# Altium project BEE-1012 PAY-EXP_V110.PrjPcb (part 1 of 7)
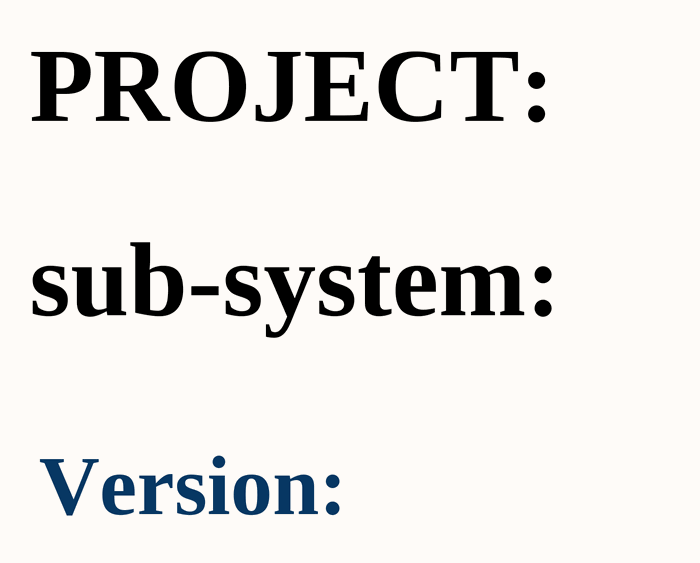
[diagram p0: 01_COVER PAGE.SchDoc]
ApprovedBy: Vu Pham; CheckedBy: Bao Bui; Date: 03/11/2026; DrawnBy: Cam Doan; MasterProject: BEE-1012; Revision: 1.1.0; SubSystem: PAY-EXP
36 sheets, 1379 parts. Net scope: flat (ports and power ports of the same name join across sheets).
Board file: BEE_1012 PAY-EXP V110.PcbDoc
Sheets:
  01_COVER PAGE.SchDoc
  02_BLOCK DIAGRAM.SchDoc
  03_INDEX.SchDoc
  04_POWER_TREE.SchDoc
  05_CONNECTOR_IN.SchDoc
  05_CONNECTOR_OUT.SchDoc
  06_POWER_1.SchDoc
  06_POWER_2.SchDoc
  06_POWER_3.SchDoc
  06_POWER_4.SchDoc
  06_POWER_5.SchDoc
  07_CAN.SchDoc
  08_SAMA7G54-MPU.SchDoc
  08_SAMA7G54-PMIC.SchDoc
  08_SAMA7G54-PIO.SchDoc
  08_SAMA7G54-DDR3.SchDoc
  08_SOM_USB_CARD.SchDoc
  09_eMMC.SchDoc
  10_USB.SchDoc
  11_MCU.SchDoc
  12_CONSOLE.SchDoc
  13_MRAM_RTC_WDT.SchDoc
  13_PRAM.SchDoc
  14_NTC_TEMPSENSOR.SchDoc
  15_HEATER.SchDoc
  16_TEC.SchDoc
  17_FLOW_Sensor.SchDoc
  17_I2C_Sensor_OnBoard.SchDoc
  18_HD4_PUMP.SchDoc
  18_HD4_PUMP_2.SchDoc
  19_SOLENOID_HB_1.SchDoc
  19_SOLENOID_OF.SchDoc
  20_AI_Board.SchDoc
  21_POWER_PWR_SEN.SchDoc
  MOUTING.SchDoc
  ANA_SWITCH.SchDoc

## Sheet 01_COVER PAGE.SchDoc
size 420 x 297 mm; DrawnBy: Sang Huynh; SheetNumber: 1; SheetTotal: 35; MasterProject: BEE-1012

### Notes on the sheet
- PROJECT:
- sub-system:
- Version:
- Project:
- Sub-system:
- Design by:
- Sheet title:
- Sheet
- of
- Checked by:
- Approved by:
- Revision:
- Document No:
- Size:
- Date:
- A3

## Sheet 02_BLOCK DIAGRAM.SchDoc
size 420 x 297 mm; SheetNumber: 2; SheetTotal: 35

### Notes on the sheet
- Project:
- Sub-system:
- Design by:
- Sheet title:
- Sheet
- of
- Checked by:
- Approved by:
- Revision:
- Document No:
- Size:
- Date:
- A3

## Sheet 03_INDEX.SchDoc
size 420 x 297 mm; SheetNumber: 3; SheetTotal: 35
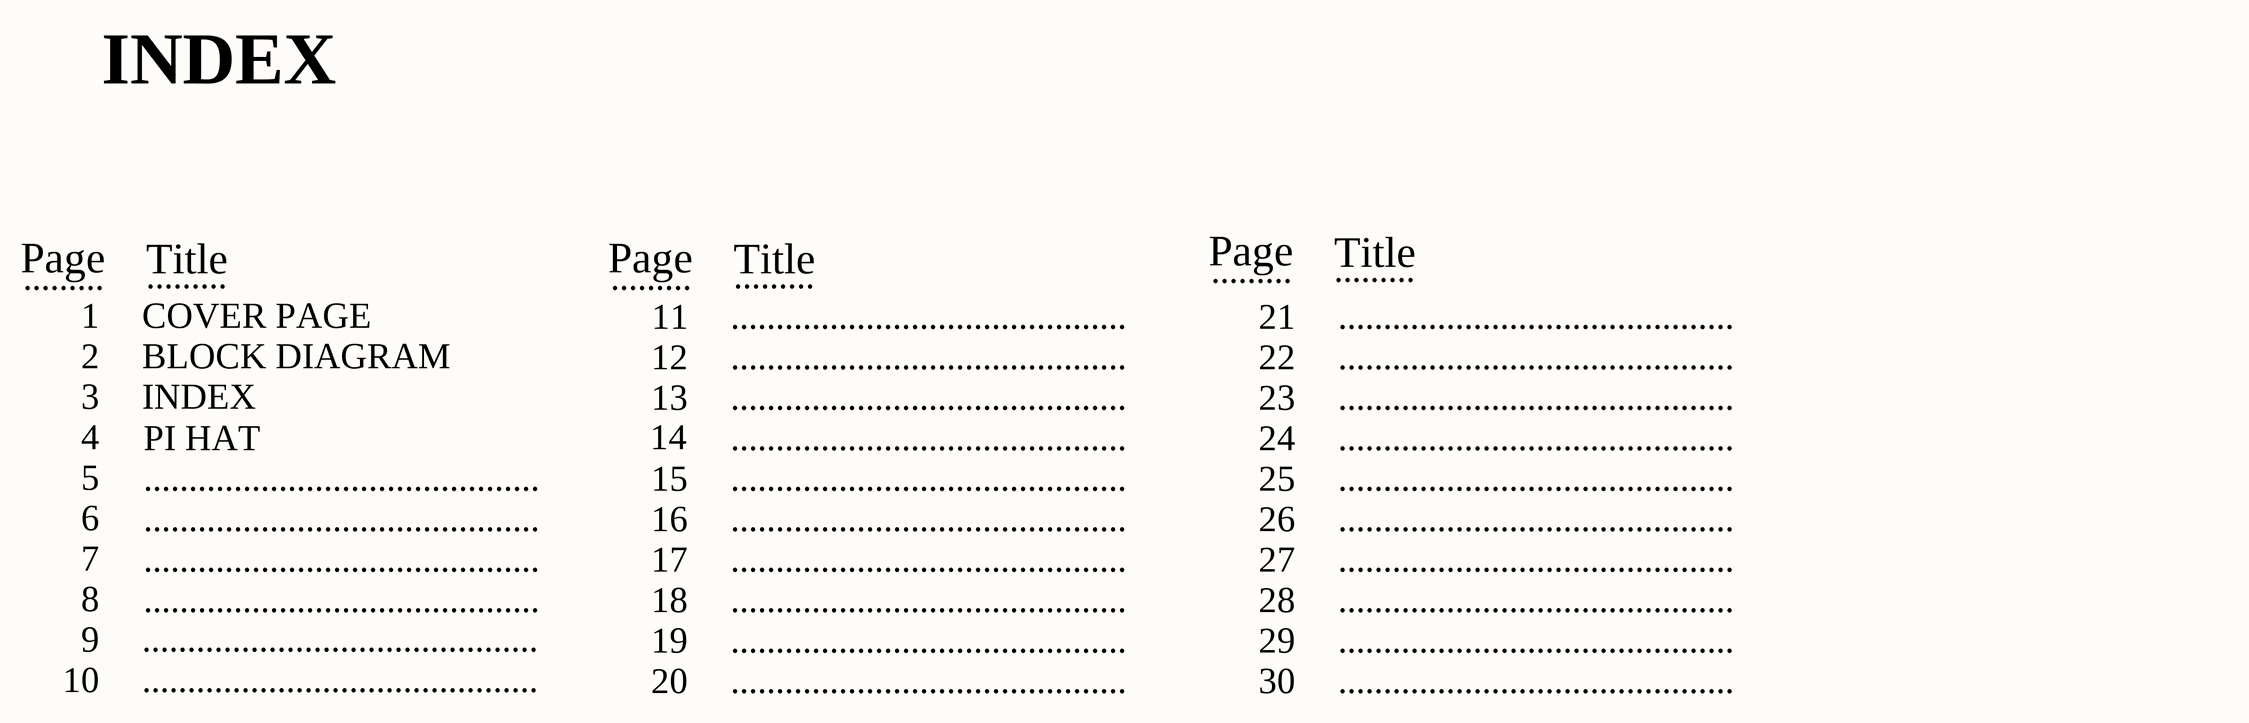
[diagram p1: 03_INDEX.SchDoc]

### Notes on the sheet
- INDEX
- Page
- .........
- Title
- 1
- 2
- COVER PAGE
- BLOCK DIAGRAM
- 11
- 12
- ............................................
- 21
- 22
- 3
- 4
- 14
- 13
- 23
- 5
- PI HAT
- 15
- 24
- 25
- 6
- 7
- 16
- 17
- 26
- 27
- 8
- 18
- 28
- 9
- 10
- 19
- 20
- 29
- 30
- Project:
- Sub-system:
- Design by:
- Sheet title:
- Sheet
- of
- Checked by:
- Approved by:
- Revision:
- Document No:
- Size:
- Date:
- A3

## Sheet 04_POWER_TREE.SchDoc
size 420 x 297 mm; SheetNumber: 4; SheetTotal: 35
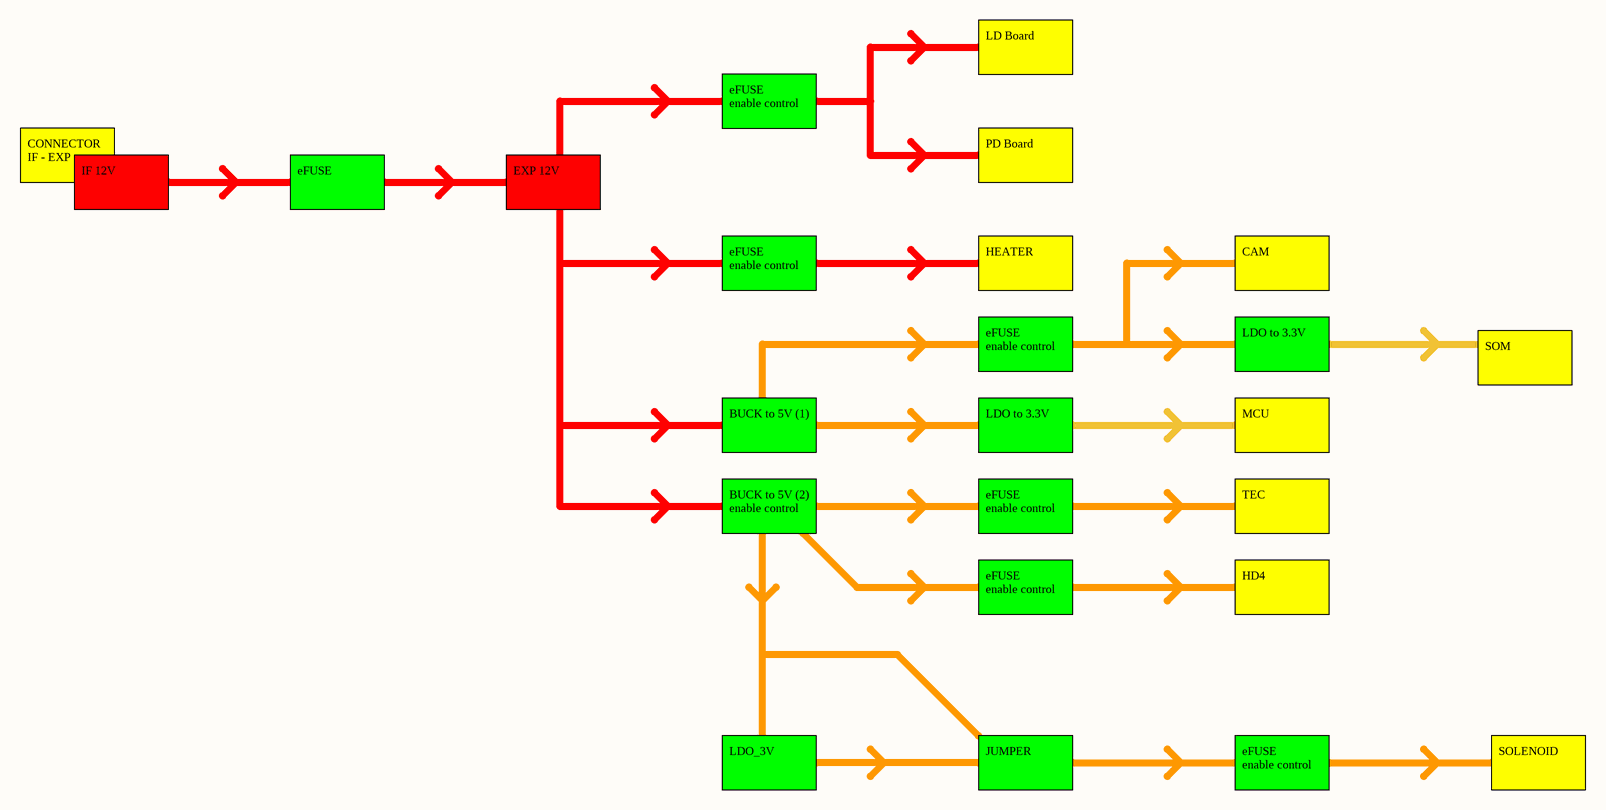
[diagram p2: 04_POWER_TREE.SchDoc]

### Notes on the sheet
- LD Board
- eFUSE
  enable control
- CONNECTOR
  IF - EXP
- IF 12V
- eFUSE
- EXP 12V
- PD Board
- HEATER
- CAM
- LDO to 3.3V
- SOM
- BUCK to 5V (1)
- MCU
- BUCK to 5V (2)
  enable control
- TEC
- HD4
- LDO_3V
- JUMPER
- SOLENOID
- Project:
- Sub-system:
- Design by:
- Sheet title:
- Sheet
- of
- Checked by:
- Approved by:
- Revision:
- Document No:
- Size:
- Date:
- A3

## Sheet 05_CONNECTOR_IN.SchDoc
size 420 x 297 mm; SheetNumber: 5; SheetTotal: 36
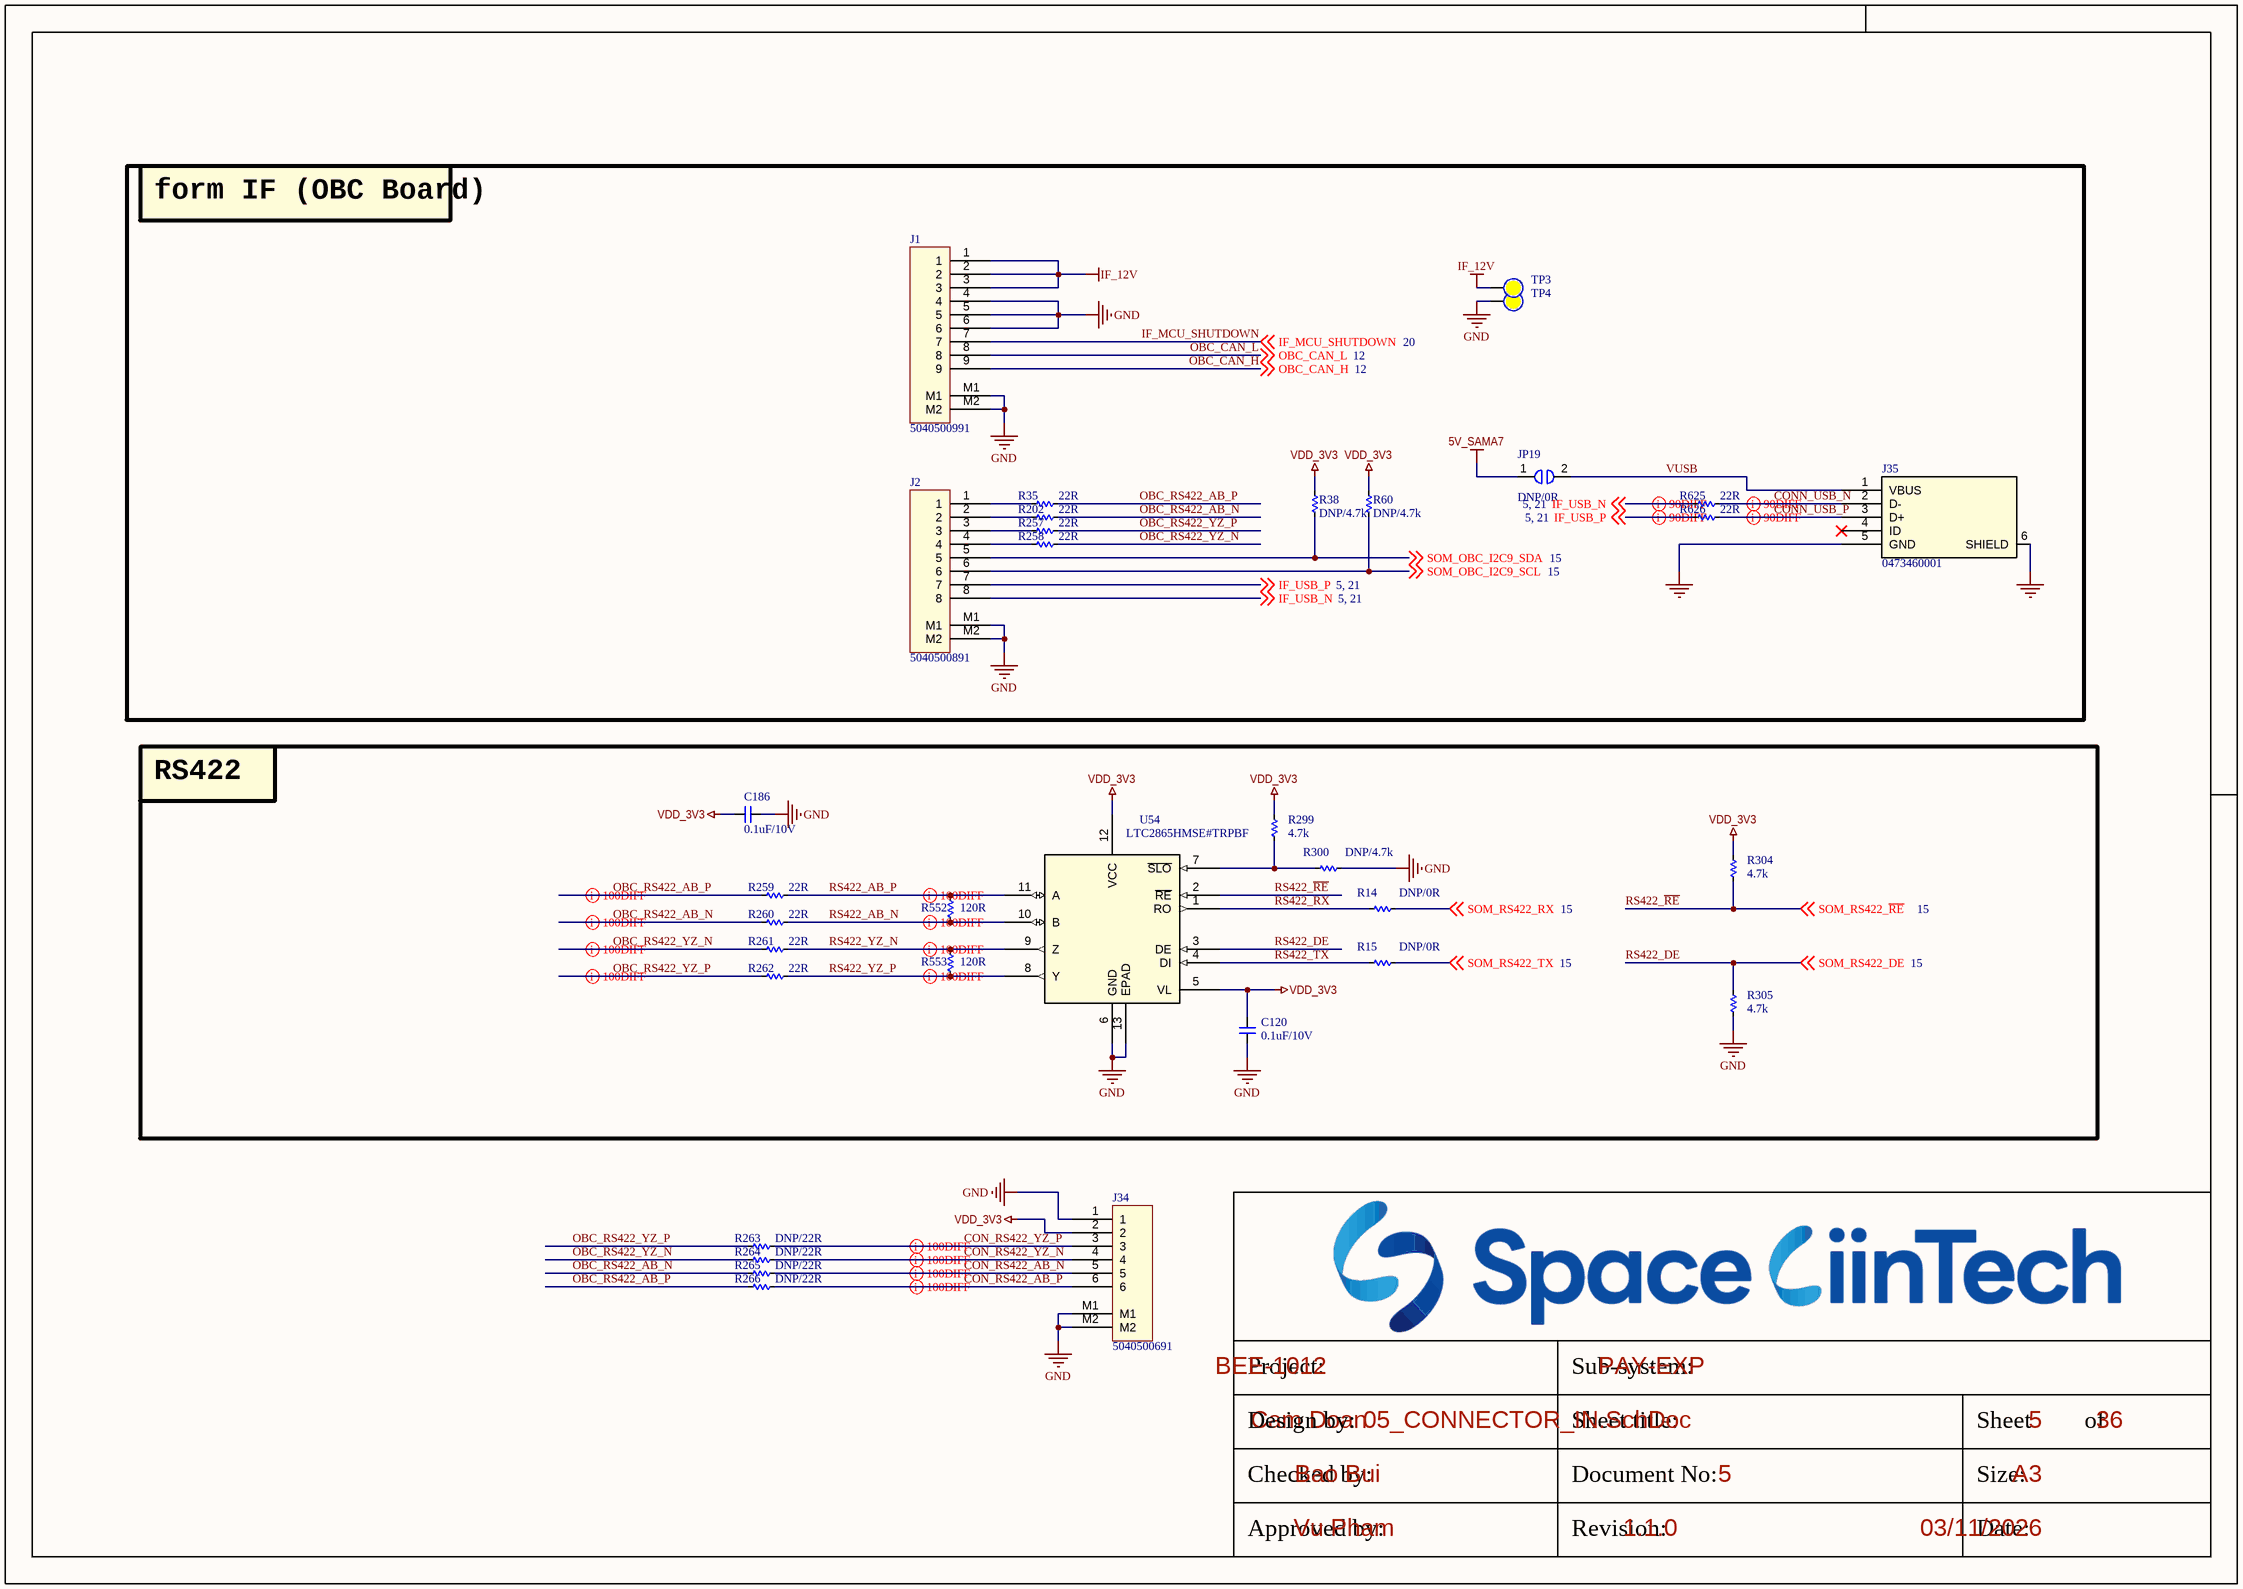
[diagram p3: 05_CONNECTOR_IN.SchDoc]

### Parts
(Parts that share a designator on the sheet are numbered #1, #2 ... from top to bottom, then left to right.)
C120  0.1uF/10V  [CAP_C_1005X60]
C186  0.1uF/10V  [CAP_C_1005X60]
J1  5040500991  [MOLEX_5040500991]
J2  5040500891  [MOLEX_5040500891]
J34  5040500691  [MOLEX_5040500691]
J35  0473460001  [47346-0001_MOL]
JP19  DNP/0R  [RES_C_1608X60]
R14  DNP/0R  [RES_C_1005X40]
R15  DNP/0R  [RES_C_1005X40]
R35  22R  [RES_C_1005X40]
R38  DNP/4.7k  [RES_C_1005X40]
R60  DNP/4.7k  [RES_C_1005X40]
R202  22R  [RES_C_1005X40]
R257  22R  [RES_C_1005X40]
R258  22R  [RES_C_1005X40]
R259  22R  [RES_C_1005X40]
R260  22R  [RES_C_1005X40]
R261  22R  [RES_C_1005X40]
R262  22R  [RES_C_1005X40]
R263  DNP/22R  [RES_C_1005X40]
R264  DNP/22R  [RES_C_1005X40]
R265  DNP/22R  [RES_C_1005X40]
R266  DNP/22R  [RES_C_1005X40]
R299  4.7k  [RES_C_1005X40]
R300  DNP/4.7k  [RES_C_1005X40]
R304  4.7k  [RES_C_1005X40]
R305  4.7k  [RES_C_1005X40]
R552  120R  [RES_C_1005X40]
R553  120R  [RES_C_1005X40]
R625  22R  [RES_C_1005X40]
R626  22R  [RES_C_1005X40]
TP3#1  (no value)  [Testpoint_TH_D130H80]  (no BOM)
TP4#1  (no value)  [Testpoint_TH_D130H80]  (no BOM)
U54  LTC2865HMSE#TRPBF  [MSOP-12_MSE_LIT]

### Blocks framed on the sheet
form IF (OBC Board): J1 J2 J35 JP19 R35 R38 R60 R202 R257 R258 R625 R626 TP3#1 TP4#1
RS422: C120 C186 R14 R15 R259-R262 R299 R300 R304 R305 R552 R553 U54

### Nets
5V_SAMA7: JP19.1
GND: C120.1 C186.1 J1.4 J1.5 J1.6 J1.M1 J1.M2 J2.M1 J2.M2 J34.1 J34.M1 J34.M2 J35.5(GND) J35.6(SHIELD) R300.2 R305.1 TP4#1.1 U54.6(GND) U54.13(EPAD)
IF_12V: J1.1 J1.2 J1.3 TP3#1.1
VDD_3V3: C120.2 C186.2 J34.2 R38.1 R60.1 R299.1 R304.1 U54.5(VL) U54.12(VCC)
CON_RS422_AB_N: J34.5 R265.2
CON_RS422_AB_P: J34.6 R266.2
CON_RS422_YZ_N: J34.4 R264.2
CON_RS422_YZ_P: J34.3 R263.2
CONN_USB_N: J35.2(D-) R625.2
CONN_USB_P: J35.3(D+) R626.2
IF_MCU_SHUTDOWN: J1.7 ; off-sheet IF_MCU_SHUTDOWN
IF_USB_N: J2.8 R625.1 ; off-sheet IF_USB_N
IF_USB_P: J2.7 R626.1 ; off-sheet IF_USB_P
OBC_CAN_H: J1.9 ; off-sheet OBC_CAN_H
OBC_CAN_L: J1.8 ; off-sheet OBC_CAN_L
OBC_RS422_AB_N: R202.2 R260.1 R265.1
OBC_RS422_AB_P: R35.2 R259.1 R266.1
OBC_RS422_YZ_N: R258.2 R261.1 R264.1
OBC_RS422_YZ_P: R257.2 R262.1 R263.1
RS422_AB_N: R260.2 R552.2 U54.10(B)
RS422_AB_P: R259.2 R552.1 U54.11(A)
RS422_DE: R305.2 U54.3(DE) ; off-sheet SOM_RS422_DE  [also labelled SOM_RS422_DE]
RS422_~{RE}: R304.2 U54.2(~{RE}) ; off-sheet SOM_RS422_~{RE}  [also labelled SOM_RS422_~{RE}]
RS422_RX: R14.1 U54.1(RO)
RS422_TX: R15.1 U54.4(DI)
RS422_YZ_N: R261.2 R553.1 U54.9(Z)
RS422_YZ_P: R262.2 R553.2 U54.8(Y)
SOM_OBC_I2C9_SCL: J2.6 R60.2 ; off-sheet SOM_OBC_I2C9_SCL
SOM_OBC_I2C9_SDA: J2.5 R38.2 ; off-sheet SOM_OBC_I2C9_SDA
SOM_RS422_RX: R14.2 ; off-sheet SOM_RS422_RX
SOM_RS422_TX: R15.2 ; off-sheet SOM_RS422_TX
VUSB: J35.1(VBUS) JP19.2
NetJ2_1: J2.1 R35.1
NetJ2_2: J2.2 R202.1
NetJ2_3: J2.3 R257.1
NetJ2_4: J2.4 R258.1
NetR299_2: R299.2 R300.1 U54.7(~{SLO})

Not connected (* = marked no-connect by the designer): J35 4(ID)*

### Layout directives
differential pair; differential pair class DIFF90: CONN_USB_N, CONN_USB_P, IF_USB_N, IF_USB_P
differential pair; differential pair class DIFF100: CON_RS422_AB_N, CON_RS422_AB_P, CON_RS422_YZ_N, CON_RS422_YZ_P, OBC_RS422_AB_N, OBC_RS422_AB_P, OBC_RS422_YZ_N, OBC_RS422_YZ_P, RS422_AB_N, RS422_AB_P, RS422_YZ_N, RS422_YZ_P

### Notes on the sheet
- Project:
- Sub-system:
- Design by:
- Sheet title:
- Sheet
- of
- Checked by:
- Approved by:
- Revision:
- Document No:
- Size:
- Date:
- A3

### Library data of the parts
C120 C186 = _CAP_C_2: CAP CHIP
J1 = Header 9x1_2M
J2 = Header 8x1_2M
J34 = Header 6x1_2M
J35 = USB_micro: No Description Available; Mfr_Name: Molex Connector Corporation; RefDes: RefDes; Type: Type
JP19 = JUMPER_1_1
R14 R15 R35 R38 R60 R202 R257-R266 R299 R300 R304 R305 R552 R553 R625 R626 = _RES_B_2: RES
TP3#1 TP4#1 = Test Point: Solder: NF
U54 = LTC2865HMSETRPBF: Â±60V Fault Protected 3V to 5.5V RS485/RS422 Transceivers; Manufacturer_Name: Analog Devices Inc; Copyright: Copyright (C) 2025 Ultra Librarian. All rights reserved.; Manufacturer_Part_Number: LTC2865HMSE#TRPBF; RefDes: RefDes; Type: Type

## Sheet 05_CONNECTOR_OUT.SchDoc
size 420 x 297 mm; SheetNumber: 6; SheetTotal: 36
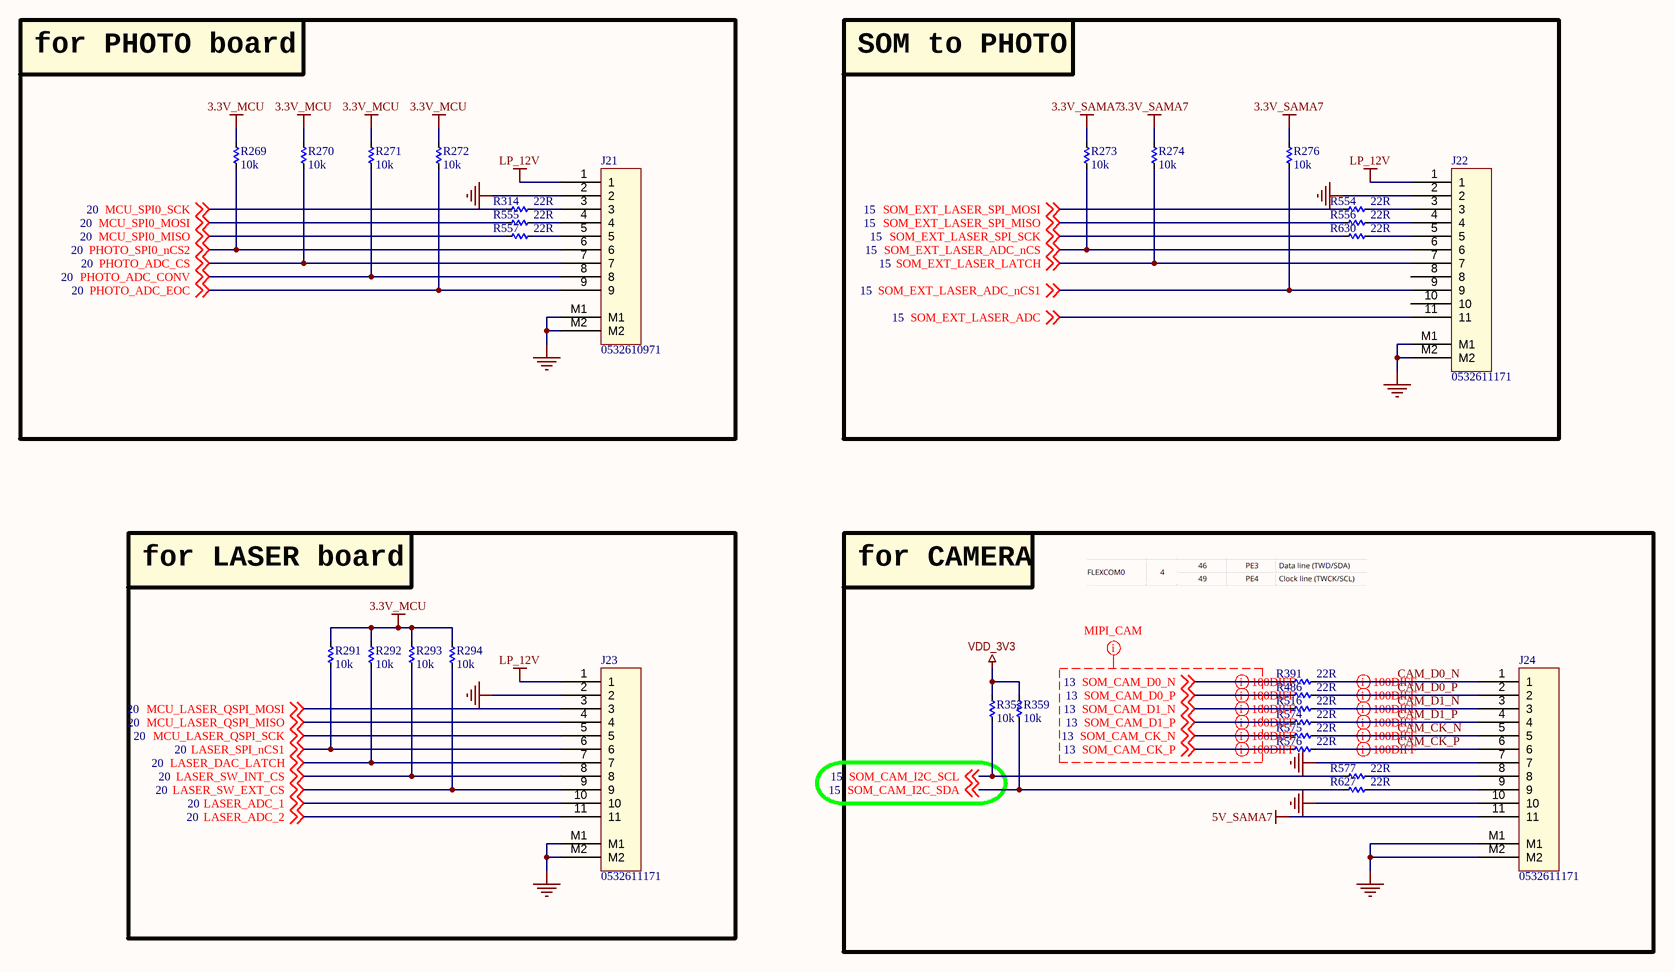
[diagram p4: 05_CONNECTOR_OUT.SchDoc]

### Parts
J21  0532610971  [MOLEX_0532610971]
J22  0532611171  [MOLEX_0532611171]
J23  0532611171  [MOLEX_0532611171]
J24  0532611171  [MOLEX_0532611171]
R269  10k  [RES_C_1005X40]
R270  10k  [RES_C_1005X40]
R271  10k  [RES_C_1005X40]
R272  10k  [RES_C_1005X40]
R273  10k  [RES_C_1005X40]
R274  10k  [RES_C_1005X40]
R276  10k  [RES_C_1005X40]
R291  10k  [RES_C_1005X40]
R292  10k  [RES_C_1005X40]
R293  10k  [RES_C_1005X40]
R294  10k  [RES_C_1005X40]
R314  22R  [RES_C_1005X40]
R352  10k  [RES_C_1005X40]
R359  10k  [RES_C_1005X40]
R391  22R  [RES_C_1005X40]
R486  22R  [RES_C_1005X40]
R516  22R  [RES_C_1005X40]
R554  22R  [RES_C_1005X40]
R555  22R  [RES_C_1005X40]
R556  22R  [RES_C_1005X40]
R557  22R  [RES_C_1005X40]
R574  22R  [RES_C_1005X40]
R575  22R  [RES_C_1005X40]
R576  22R  [RES_C_1005X40]
R577  22R  [RES_C_1005X40]
R627  22R  [RES_C_1005X40]
R630  22R  [RES_C_1005X40]

### Blocks framed on the sheet
for PHOTO board: J21 R269-R272 R314 R555 R557
SOM to PHOTO: J22 R273 R274 R276 R554 R556 R630
for LASER board: J23 R291-R294
for CAMERA: J24 R352 R359 R391 R486 R516 R574-R577 R627

### Nets
3.3V_MCU: R269.1 R270.1 R271.1 R272.1 R291.1 R292.1 R293.1 R294.1
3.3V_SAMA7: R273.1 R274.1 R276.1
5V_SAMA7: J24.11
GND: J21.2 J21.M1 J21.M2 J22.2 J22.M1 J22.M2 J23.2 J23.M1 J23.M2 J24.7 J24.10 J24.M1 J24.M2
LP_12V: J21.1 J22.1 J23.1
VDD_3V3: R352.1 R359.1
CAM_CK_N: J24.5 R575.2
CAM_CK_P: J24.6 R576.2
CAM_D0_N: J24.1 R391.2
CAM_D0_P: J24.2 R486.2
CAM_D1_N: J24.3 R516.2
CAM_D1_P: J24.4 R574.2
LASER_ADC_1: J23.10 ; off-sheet LASER_ADC_1
LASER_ADC_2: J23.11 ; off-sheet LASER_ADC_2
LASER_DAC_LATCH: J23.7 R292.2 ; off-sheet LASER_DAC_LATCH
LASER_SPI_nCS1: J23.6 R291.2 ; off-sheet LASER_SPI_nCS1
LASER_SW_EXT_CS: J23.9 R294.2 ; off-sheet LASER_SW_EXT_CS
LASER_SW_INT_CS: J23.8 R293.2 ; off-sheet LASER_SW_INT_CS
MCU_LASER_QSPI_MISO: J23.4 ; off-sheet MCU_LASER_QSPI_MISO
MCU_LASER_QSPI_MOSI: J23.3 ; off-sheet MCU_LASER_QSPI_MOSI
MCU_LASER_QSPI_SCK: J23.5 ; off-sheet MCU_LASER_QSPI_SCK
MCU_SPI0_MISO: R557.1 ; off-sheet MCU_SPI0_MISO
MCU_SPI0_MOSI: R555.1 ; off-sheet MCU_SPI0_MOSI
MCU_SPI0_SCK: R314.1 ; off-sheet MCU_SPI0_SCK
PHOTO_ADC_CONV: J21.8 R271.2 ; off-sheet PHOTO_ADC_CONV
PHOTO_ADC_CS: J21.7 R270.2 ; off-sheet PHOTO_ADC_CS
PHOTO_ADC_EOC: J21.9 R272.2 ; off-sheet PHOTO_ADC_EOC
PHOTO_SPI0_nCS2: J21.6 R269.2 ; off-sheet PHOTO_SPI0_nCS2
SOM_CAM_CK_N: R575.1 ; off-sheet SOM_CAM_CK_N  [project net MIPI_CK_N]
SOM_CAM_CK_P: R576.1 ; off-sheet SOM_CAM_CK_P  [project net MIPI_CK_P]
SOM_CAM_D0_N: R391.1 ; off-sheet SOM_CAM_D0_N  [project net MIPI_D0_N]
SOM_CAM_D0_P: R486.1 ; off-sheet SOM_CAM_D0_P  [project net MIPI_D0_P]
SOM_CAM_D1_N: R516.1 ; off-sheet SOM_CAM_D1_N  [project net MIPI_D1_N]
SOM_CAM_D1_P: R574.1 ; off-sheet SOM_CAM_D1_P  [project net MIPI_D1_P]
SOM_CAM_I2C_SCL: R352.2 R577.1 ; off-sheet SOM_CAM_I2C_SCL
SOM_CAM_I2C_SDA: R359.2 R627.1 ; off-sheet SOM_CAM_I2C_SDA
SOM_EXT_LASER_ADC: J22.11 ; off-sheet SOM_EXT_LASER_ADC
SOM_EXT_LASER_ADC_nCS: J22.6 R273.2 ; off-sheet SOM_EXT_LASER_ADC_nCS
SOM_EXT_LASER_ADC_nCS1: J22.9 R276.2 ; off-sheet SOM_EXT_LASER_ADC_nCS1
SOM_EXT_LASER_LATCH: J22.7 R274.2 ; off-sheet SOM_EXT_LASER_LATCH
SOM_EXT_LASER_SPI_MISO: R556.1 ; off-sheet SOM_EXT_LASER_SPI_MISO
SOM_EXT_LASER_SPI_MOSI: R554.1 ; off-sheet SOM_EXT_LASER_SPI_MOSI
SOM_EXT_LASER_SPI_SCK: R630.1 ; off-sheet SOM_EXT_LASER_SPI_SCK
NetJ21_3: J21.3 R314.2
NetJ21_4: J21.4 R555.2
NetJ21_5: J21.5 R557.2
NetJ22_3: J22.3 R554.2
NetJ22_4: J22.4 R556.2
NetJ22_5: J22.5 R630.2
NetJ24_8: J24.8 R577.2
NetJ24_9: J24.9 R627.2

Not connected (* = marked no-connect by the designer): J22 8 10

### Layout directives
differential pair; differential pair class DIFF100: CAM_CK_N, CAM_CK_P, CAM_D0_N, CAM_D0_P, CAM_D1_N, CAM_D1_P, MIPI_CK_N, MIPI_CK_P, MIPI_D0_N, MIPI_D0_P, MIPI_D1_N, MIPI_D1_P
net class MIPI_CAM: SOM_CAM_CK_N, SOM_CAM_CK_P, SOM_CAM_D0_N, SOM_CAM_D0_P, SOM_CAM_D1_N, SOM_CAM_D1_P

### Notes on the sheet
- Project:
- Sub-system:
- Design by:
- Sheet title:
- Sheet
- of
- Checked by:
- Approved by:
- Revision:
- Document No:
- Size:
- Date:
- A3

### Library data of the parts
J21 = Header 9x1_2M
J22-J24 = Header 11x1_2M
R269-R274 R276 R291-R294 R314 R352 R359 R391 R486 R516 R554-R557 R574-R577 R627 R630 = _RES_B_2: RES

## Sheet 06_POWER_1.SchDoc
size 420 x 297 mm; SheetNumber: 7; SheetTotal: 35
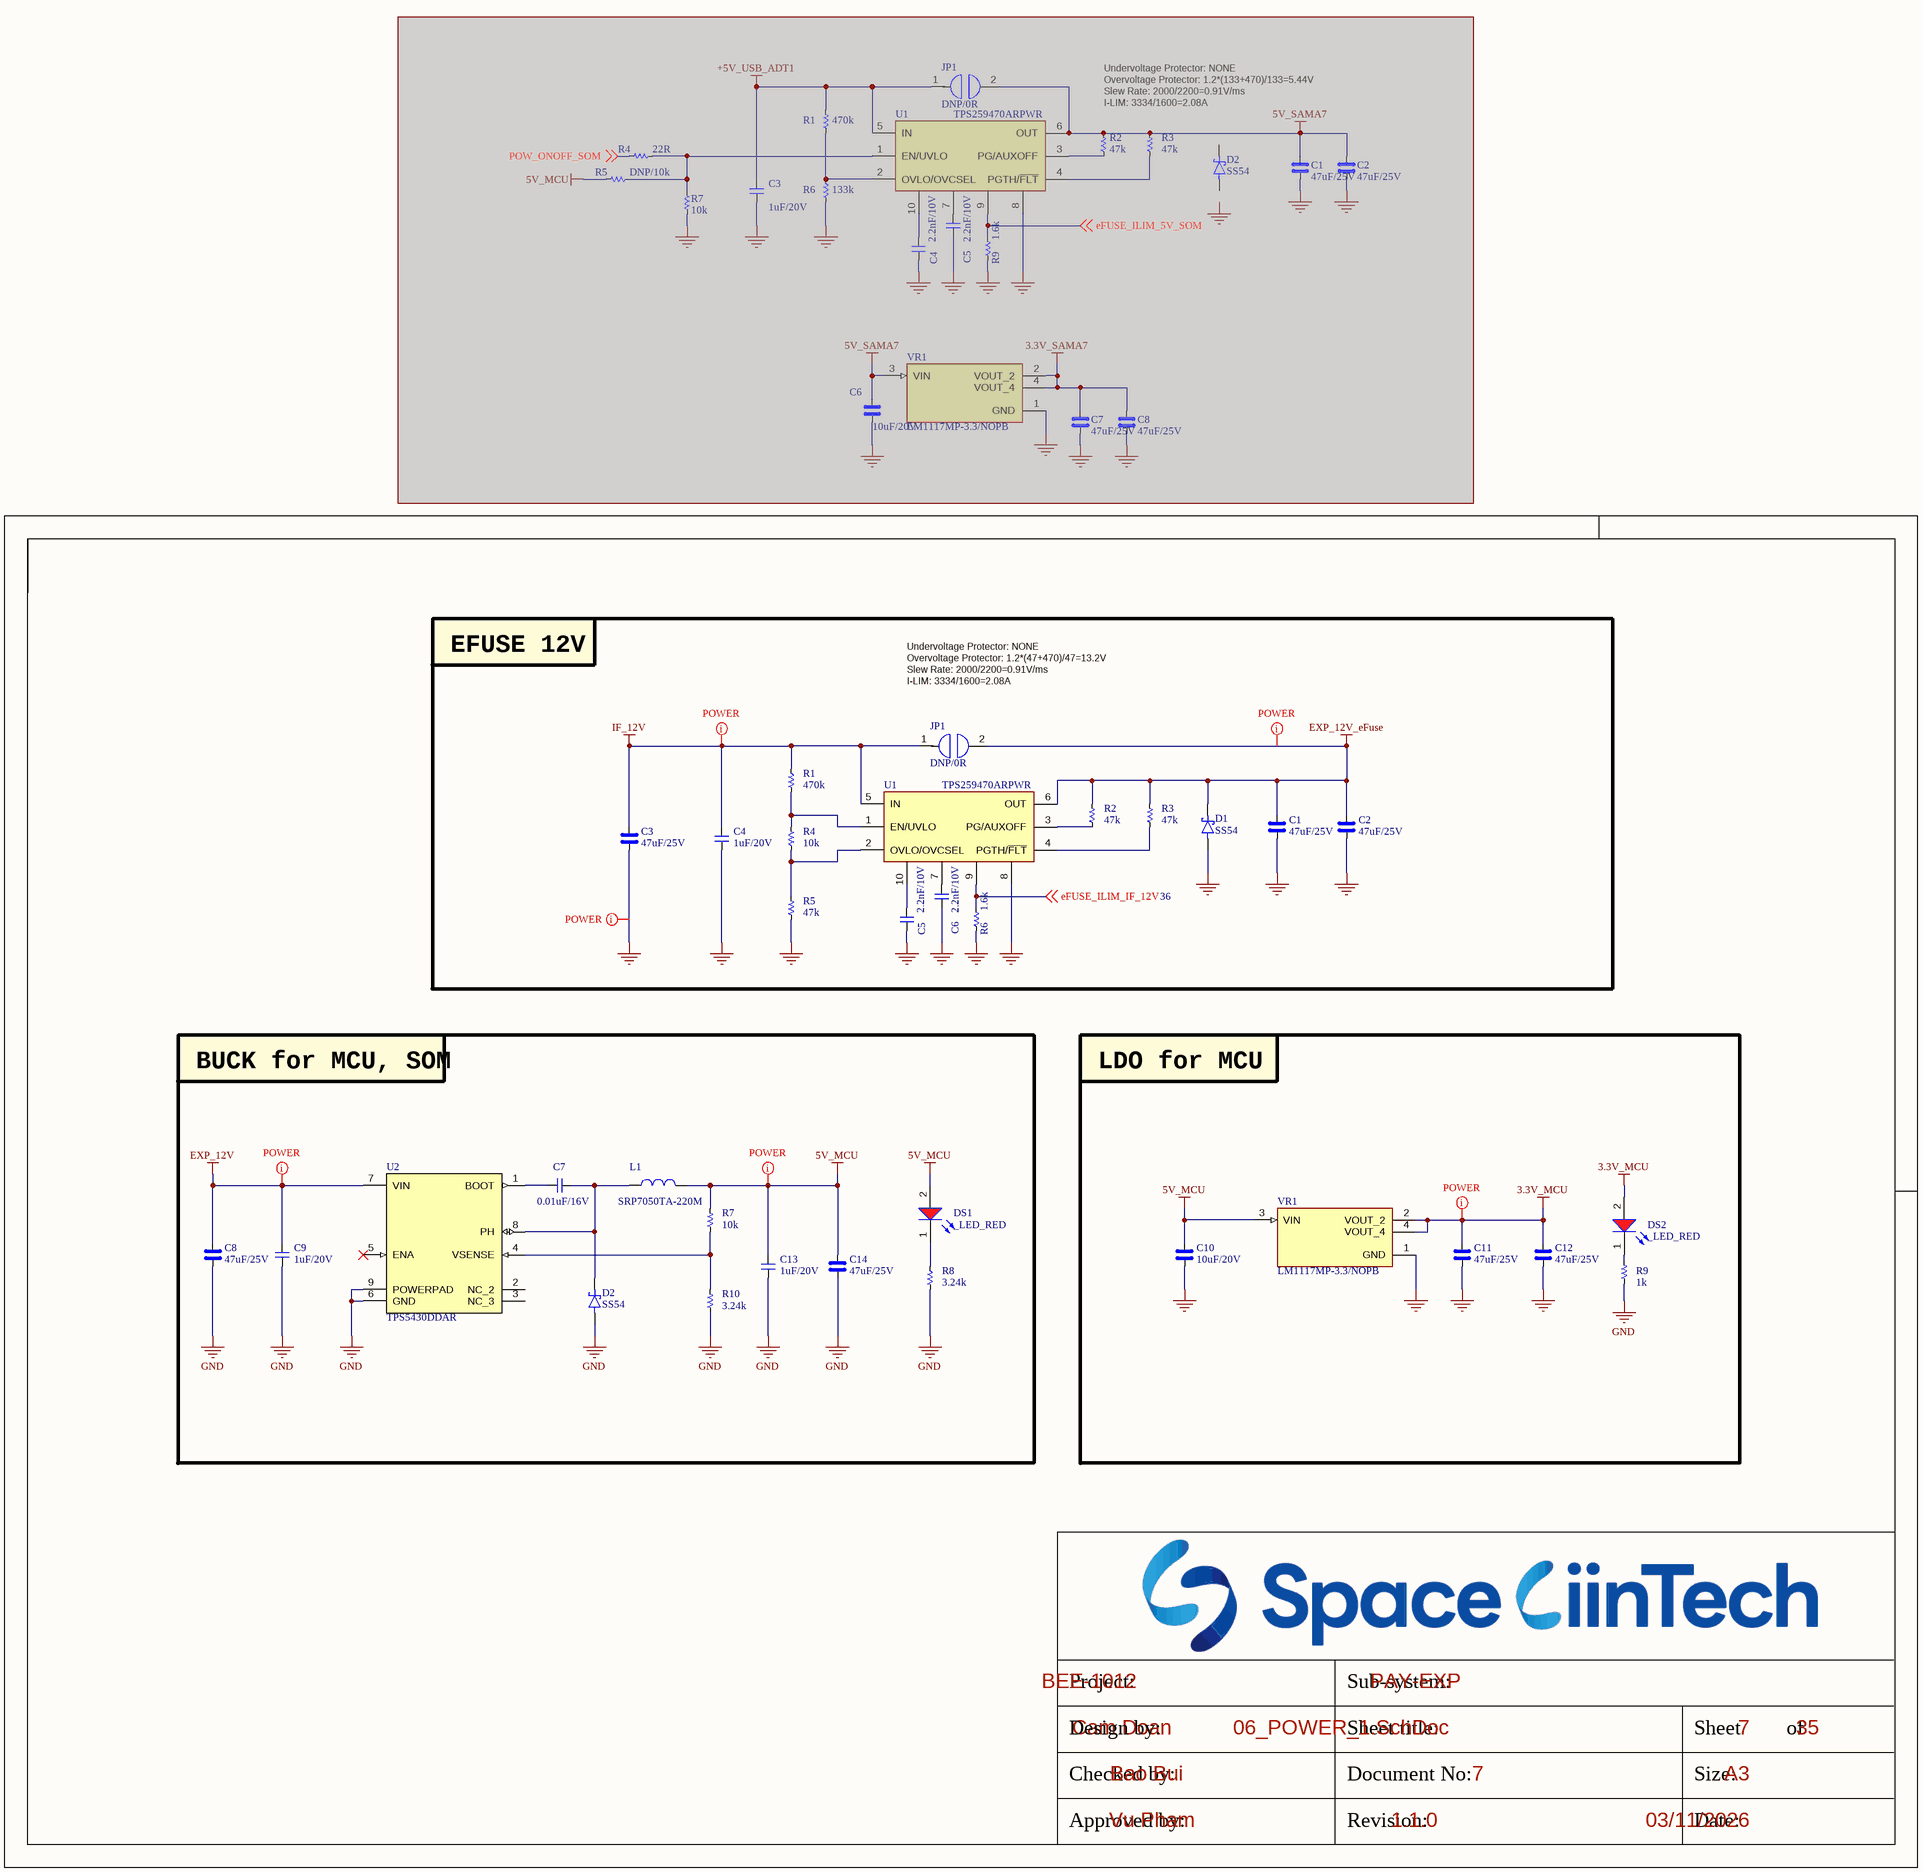
[diagram p5: 06_POWER_1.SchDoc]

### Parts
(Parts that share a designator on the sheet are numbered #1, #2 ... from top to bottom, then left to right.)
C1#1  47uF/25V  [CAP_C_3225X80]  (masked out: inside a compile mask, not in the netlist)
C1#2  47uF/25V  [CAP_C_3225X80]
C2#1  47uF/25V  [CAP_C_3225X80]  (masked out: inside a compile mask, not in the netlist)
C2#2  47uF/25V  [CAP_C_3225X80]
C3#1  1uF/20V  [CAP_C_1005X60]  (masked out: inside a compile mask, not in the netlist)
C3#2  47uF/25V  [CAP_C_3225X80]
C4#1  2.2nF/10V  [CAP_C_1005X60]  (masked out: inside a compile mask, not in the netlist)
C4#2  1uF/20V  [CAP_C_1005X60]
C5#1  2.2nF/10V  [CAP_C_1005X60]  (masked out: inside a compile mask, not in the netlist)
C5#2  2.2nF/10V  [CAP_C_1005X60]
C6#1  10uF/20V  [CAP_C_2012X110]  (masked out: inside a compile mask, not in the netlist)
C6#2  2.2nF/10V  [CAP_C_1005X60]
C7#1  47uF/25V  [CAP_C_3225X80]  (masked out: inside a compile mask, not in the netlist)
C7#2  0.01uF/16V  [CAP_C_1608X80]
C8#1  47uF/25V  [CAP_C_3225X80]  (masked out: inside a compile mask, not in the netlist)
C8#2  47uF/25V  [CAP_C_3225X80]
C9  1uF/20V  [CAP_C_1005X60]
C10  10uF/20V  [CAP_C_2012X110]
C11  47uF/25V  [CAP_C_3225X80]
C12  47uF/25V  [CAP_C_3225X80]
C13  1uF/20V  [CAP_C_1005X60]
C14  47uF/25V  [CAP_C_3225X80]
D1  SS54  [DO-214AC_SMA]
D2#1  SS54  [DO-214AC_SMA]  (masked out: inside a compile mask, not in the netlist)
D2#2  SS54  [DO-214AC_SMA]
DS1  _LED_RED  [LED_0603]
DS2  _LED_RED  [LED_0603]
JP1#1  DNP/0R  [JUMPER_1608]  (masked out: inside a compile mask, not in the netlist)
JP1#2  DNP/0R  [JUMPER_1608]
L1  SRP7050TA-220M  [PSM6050]
R1#1  470k  [RES_C_1005X40]  (masked out: inside a compile mask, not in the netlist)
R1#2  470k  [RES_C_1005X40]
R2#1  47k  [RES_C_1005X40]  (masked out: inside a compile mask, not in the netlist)
R2#2  47k  [RES_C_1005X40]
R3#1  47k  [RES_C_1005X40]  (masked out: inside a compile mask, not in the netlist)
R3#2  47k  [RES_C_1005X40]
R4#1  22R  [RES_C_1005X40]  (masked out: inside a compile mask, not in the netlist)
R4#2  10k  [RES_C_1005X40]
R5#1  DNP/10k  [RES_C_1005X40]  (masked out: inside a compile mask, not in the netlist)
R5#2  47k  [RES_C_1005X40]
R6#1  133k  [RES_C_1005X40]  (masked out: inside a compile mask, not in the netlist)
R6#2  1.6k  [RES_C_1005X40]
R7#1  10k  [RES_C_1005X40]  (masked out: inside a compile mask, not in the netlist)
R7#2  10k  [RES_C_1005X40]
R8  3.24k  [RES_C_1005X40]
R9#1  1.6k  [RES_C_1005X40]  (masked out: inside a compile mask, not in the netlist)
R9#2  1k  [RES_C_1005X40]
R10  3.24k  [RES_C_1005X40]
U1#1  TPS259470ARPWR  [VQFN-HR-10]  (masked out: inside a compile mask, not in the netlist)
U1#2  TPS259470ARPWR  [VQFN-HR-10]
U2  TPS5430DDAR  [TPS54531DDAR]
VR1#1  LM1117MP-3.3/NOPB  [VREG_LM1117MP-3.3/NOPB]  (masked out: inside a compile mask, not in the netlist)
VR1#2  LM1117MP-3.3/NOPB  [VREG_LM1117MP-3.3/NOPB]

### Blocks framed on the sheet
EFUSE 12V: C1#2 C2#2 C3#2 C4#2 C5#2 C6#2 D1 JP1#2 R1#2 R2#2 R3#2 R4#2 R5#2 R6#2 U1#2
BUCK for MCU, SOM: C7#2 C8#2 C9 C13 C14 D2#2 DS1 L1 R7#2 R8 R10 U2
LDO for MCU: C10-C12 DS2 R9#2 VR1#2

### Nets
3.3V_MCU: C11.2 C12.2 DS2.2(A) VR1#2.2(VOUT_2) VR1#2.4(VOUT_4)
5V_MCU: C10.1 C13.2 C14.2 DS1.2(A) L1.2 R7#2.2 VR1#2.3(VIN)
EXP_12V: C8#2.2 C9.2 U2.7(VIN)
EXP_12V_eFuse: C1#2.2 C2#2.2 D1.1(K) JP1#2.2 R2#2.2 R3#2.2 U1#2.6(OUT)
GND: C1#2.1 C2#2.1 C3#2.1 C4#2.1 C5#2.1 C6#2.1 C8#2.1 C9.1 C10.2 C11.1 C12.1 C13.1 C14.1 D1.2(A) D2#2.2(A) R5#2.1 R6#2.1 R8.1 R9#2.1 R10.1 U1#2.8 U2.6(GND) U2.9(POWERPAD) VR1#2.1(GND)
IF_12V: C3#2.2 C4#2.2 JP1#2.1 R1#2.2 U1#2.5(IN)
eFUSE_ILIM_IF_12V: R6#2.2 U1#2.9 ; off-sheet eFUSE_ILIM_IF_12V
NetC5#2_2: C5#2.2 U1#2.10
NetC6#2_2: C6#2.2 U1#2.7
NetC7#2_1: C7#2.1 D2#2.1(K) L1.1 U2.8(PH)
NetC7#2_2: C7#2.2 U2.1(BOOT)
NetDS1_1: DS1.1(K) R8.2
NetDS2_1: DS2.1(K) R9#2.2
NetR1#2_1: R1#2.1 R4#2.1 U1#2.1(EN/UVLO)
NetR2#2_1: R2#2.1 U1#2.3(PG/AUXOFF)
NetR3#2_1: R3#2.1 U1#2.4(PGTH/~{FLT})
NetR4#2_2: R4#2.2 R5#2.2 U1#2.2(OVLO/OVCSEL)
NetR7#2_1: R7#2.1 R10.2 U2.4(VSENSE)

Not connected (* = marked no-connect by the designer): U2 2(NC_2) 3(NC_3) 5(ENA)*

### Layout directives
net class POWER: 3.3V_MCU, 5V_MCU, EXP_12V, EXP_12V_eFuse, GND, IF_12V

### Notes on the sheet
- Undervoltage Protector: NONE
- Overvoltage Protector: 1.2*(133+470)/133=5.44V
- Slew Rate: 2000/2200=0.91V/ms
- I-LIM: 3334/1600=2.08A
- Overvoltage Protector: 1.2*(47+470)/47=13.2V
- Project:
- Sub-system:
- Design by:
- Sheet title:
- Sheet
- of
- Checked by:
- Approved by:
- Revision:
- Document No:
- Size:
- Date:
- A3

### Library data of the parts
C1#1 C1#2 C2#1 C2#2 C3#2 C6#1 C7#1 C8#1 C8#2 C10-C12 C14 = _CAP_C_High_2: CAP High Value
C3#1 C4#1 C4#2 C5#1 C5#2 C6#2 C7#2 C9 C13 = _CAP_C_2: CAP
D1 D2#1 D2#2 = DIODE SCHOTTKY
JP1#1 JP1#2 = JUMPER
L1 = SRP7050TA-220M: FIXED IND 22UH 2.5A 170 MOHM SMD
R1#1 R1#2 R2#1 R2#2 R3#1 R3#2 R4#1 R4#2 R5#1 R5#2 R6#1 R6#2 R7#1 R7#2 R8 R9#1 R9#2 R10 = _RES_B_2: RES
U2 = TPS5430DDAR: IC REG BUCK ADJ 3A 8SOPWR
VR1#1 VR1#2 = LM1117MP-3.3/NOPB: 800-mA 15-V linear voltage regulator; MF: Texas Instruments; SnapEDA_Link: https://www.snapeda.com/parts/LM1117MP-3.3/NOPB/Texas+Instruments/view-part/?ref=snap; Package: SOT-223-4 Texas Instruments; Value: *; MP: LM1117MP-3.3/NOPB; Check_prices: https://www.snapeda.com/parts/LM1117MP-3.3/NOPB/Texas+Instruments/view-part/?ref=eda

## Sheet 06_POWER_2.SchDoc
size 420 x 297 mm; SheetNumber: 8; SheetTotal: 35
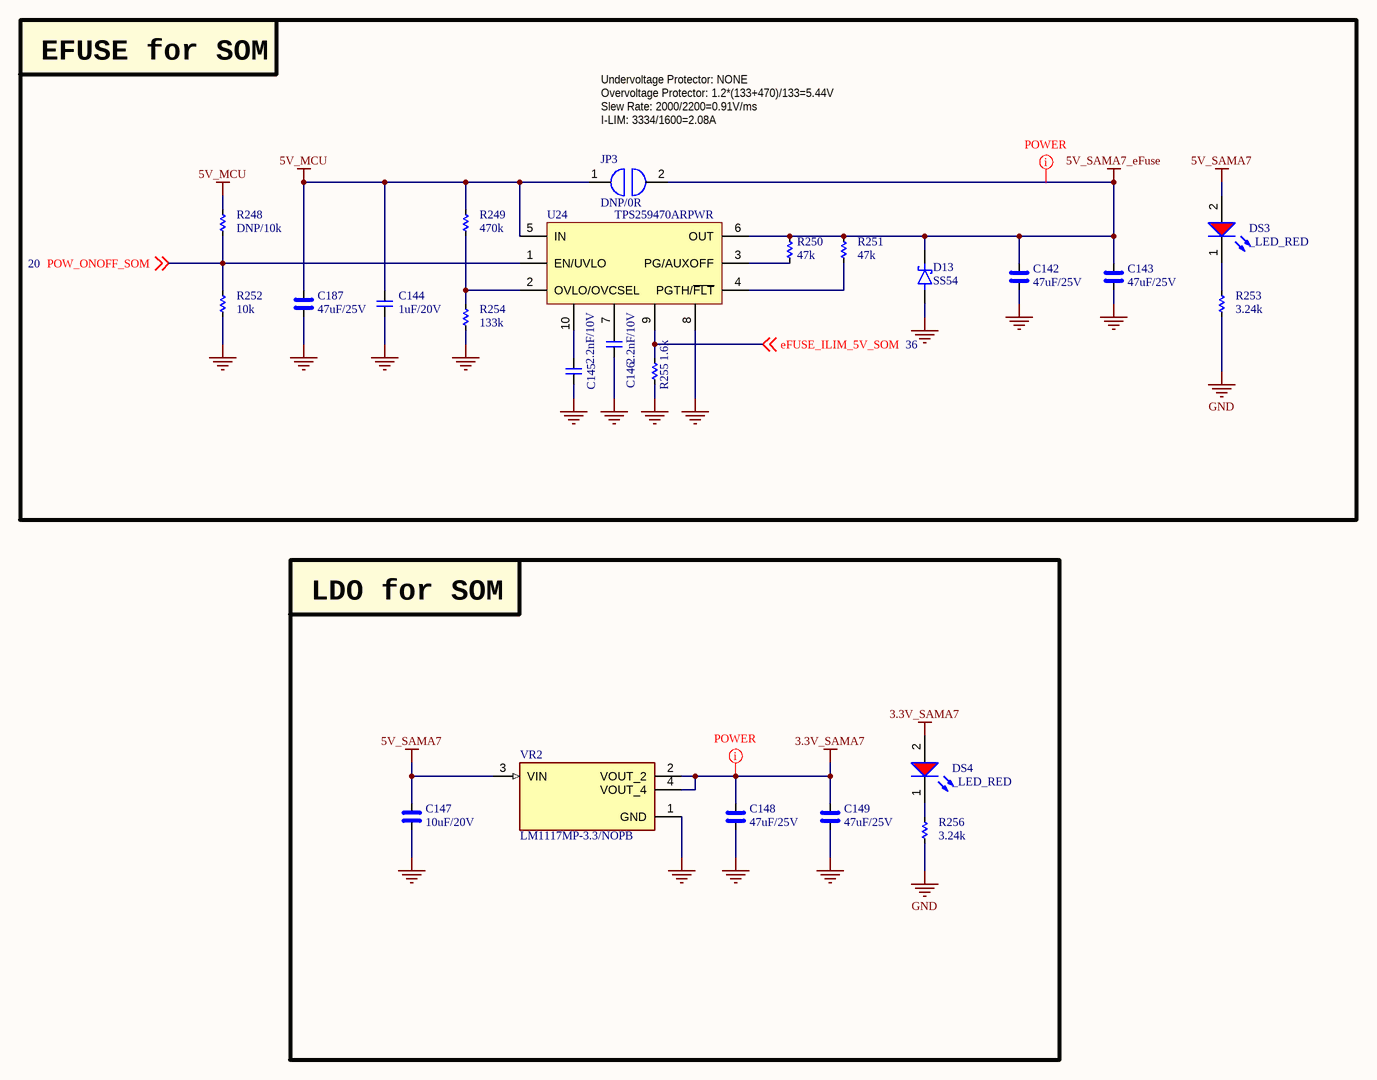
[diagram p6: 06_POWER_2.SchDoc]

### Parts
C142  47uF/25V  [CAP_C_3225X80]
C143  47uF/25V  [CAP_C_3225X80]
C144  1uF/20V  [CAP_C_1005X60]
C145  2.2nF/10V  [CAP_C_1005X60]
C146  2.2nF/10V  [CAP_C_1005X60]
C147  10uF/20V  [CAP_C_2012X110]
C148  47uF/25V  [CAP_C_3225X80]
C149  47uF/25V  [CAP_C_3225X80]
C187  47uF/25V  [CAP_C_3225X80]
D13  SS54  [DO-214AC_SMA]
DS3  _LED_RED  [LED_0603]
DS4  _LED_RED  [LED_0603]
JP3  DNP/0R  [JUMPER_1608]
R248  DNP/10k  [RES_C_1005X40]
R249  470k  [RES_C_1005X40]
R250  47k  [RES_C_1005X40]
R251  47k  [RES_C_1005X40]
R252  10k  [RES_C_1005X40]
R253  3.24k  [RES_C_1005X40]
R254  133k  [RES_C_1005X40]
R255  1.6k  [RES_C_1005X40]
R256  3.24k  [RES_C_1005X40]
U24  TPS259470ARPWR  [VQFN-HR-10]
VR2  LM1117MP-3.3/NOPB  [VREG_LM1117MP-3.3/NOPB]

### Blocks framed on the sheet
EFUSE for SOM: C142-C146 C187 D13 DS3 JP3 R248-R255 U24
LDO for SOM: C147-C149 DS4 R256 VR2

### Nets
3.3V_SAMA7: C148.2 C149.2 DS4.2(A) VR2.2(VOUT_2) VR2.4(VOUT_4)
5V_MCU: C144.2 C187.2 JP3.1 R248.1 R249.2 U24.5(IN)
5V_SAMA7: C147.1 DS3.2(A) VR2.3(VIN)
5V_SAMA7_eFuse: C142.2 C143.2 D13.1(K) JP3.2 R250.2 R251.2 U24.6(OUT)
GND: C142.1 C143.1 C144.1 C145.1 C146.1 C147.2 C148.1 C149.1 C187.1 D13.2(A) R252.2 R253.1 R254.1 R255.1 R256.1 U24.8 VR2.1(GND)
eFUSE_ILIM_5V_SOM: R255.2 U24.9 ; off-sheet eFUSE_ILIM_5V_SOM
POW_ONOFF_SOM: R248.2 R252.1 U24.1(EN/UVLO) ; off-sheet POW_ONOFF_SOM
NetC145_2: C145.2 U24.10
NetC146_2: C146.2 U24.7
NetDS3_1: DS3.1(K) R253.2
NetDS4_1: DS4.1(K) R256.2
NetR249_1: R249.1 R254.2 U24.2(OVLO/OVCSEL)
NetR250_1: R250.1 U24.3(PG/AUXOFF)
NetR251_1: R251.1 U24.4(PGTH/~{FLT})

### Layout directives
net class POWER: 3.3V_SAMA7, 5V_SAMA7_eFuse

### Notes on the sheet
- Undervoltage Protector: NONE
- Overvoltage Protector: 1.2*(133+470)/133=5.44V
- Slew Rate: 2000/2200=0.91V/ms
- I-LIM: 3334/1600=2.08A
- Project:
- Sub-system:
- Design by:
- Sheet title:
- Sheet
- of
- Checked by:
- Approved by:
- Revision:
- Document No:
- Size:
- Date:
- A3

### Library data of the parts
C142 C143 C147-C149 C187 = _CAP_C_High_2: CAP High Value
C144-C146 = _CAP_C_2: CAP
D13 = DIODE SCHOTTKY
JP3 = JUMPER
R248-R256 = _RES_B_2: RES
VR2 = LM1117MP-3.3/NOPB: as VR1#1 on sheet 06_POWER_1; SnapEDA_Link: https://www.snapeda.com/parts/LM1117MP-3.3/NOPB/Texas+Instruments/view-part/?ref=snap; Package: SOT-223-4 Texas Instruments; Value: *; MP: LM1117MP-3.3/NOPB; Check_prices: https://www.snapeda.com/parts/LM1117MP-3.3/NOPB/Texas+Instruments/view-part/?ref=eda

## Sheet 06_POWER_3.SchDoc
size 420 x 297 mm; SheetNumber: 9; SheetTotal: 35
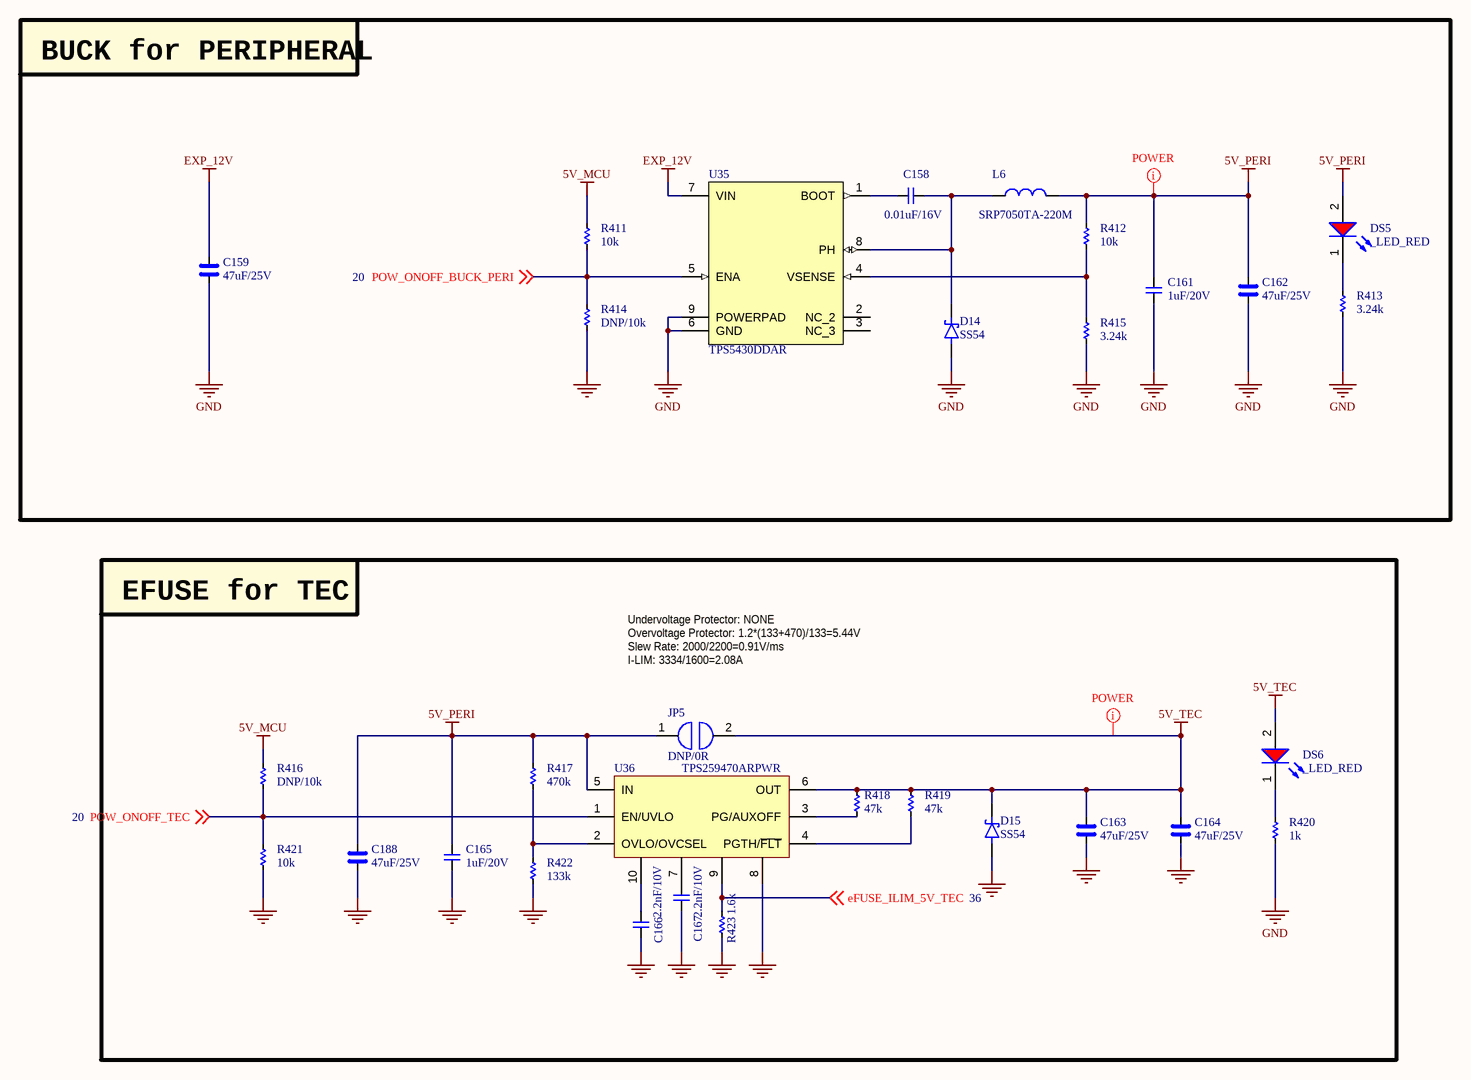
[diagram p7: 06_POWER_3.SchDoc]

### Parts
C158  0.01uF/16V  [CAP_C_1608X80]
C159  47uF/25V  [CAP_C_3225X80]
C161  1uF/20V  [CAP_C_1005X60]
C162  47uF/25V  [CAP_C_3225X80]
C163  47uF/25V  [CAP_C_3225X80]
C164  47uF/25V  [CAP_C_3225X80]
C165  1uF/20V  [CAP_C_1005X60]
C166  2.2nF/10V  [CAP_C_1005X60]
C167  2.2nF/10V  [CAP_C_1005X60]
C188  47uF/25V  [CAP_C_3225X80]
D14  SS54  [DO-214AC_SMA]
D15  SS54  [DO-214AC_SMA]
DS5  _LED_RED  [LED_0603]
DS6  _LED_RED  [LED_0603]
JP5  DNP/0R  [JUMPER_1608]
L6  SRP7050TA-220M  [PSM6050]
R411  10k  [RES_C_1005X40]
R412  10k  [RES_C_1005X40]
R413  3.24k  [RES_C_1005X40]
R414  DNP/10k  [RES_C_1005X40]
R415  3.24k  [RES_C_1005X40]
R416  DNP/10k  [RES_C_1005X40]
R417  470k  [RES_C_1005X40]
R418  47k  [RES_C_1005X40]
R419  47k  [RES_C_1005X40]
R420  1k  [RES_C_1005X40]
R421  10k  [RES_C_1005X40]
R422  133k  [RES_C_1005X40]
R423  1.6k  [RES_C_1005X40]
U35  TPS5430DDAR  [TPS54531DDAR]
U36  TPS259470ARPWR  [VQFN-HR-10]

### Blocks framed on the sheet
BUCK for PERIPHERAL: C158 C159 C161 C162 D14 DS5 L6 R411-R415 U35
EFUSE for TEC: C163-C167 C188 D15 DS6 JP5 R416-R423 U36

### Nets
5V_MCU: R411.1 R416.1
5V_PERI: C161.2 C162.2 C165.2 C188.2 DS5.2(A) JP5.1 L6.2 R412.2 R417.2 U36.5(IN)
5V_TEC: C163.2 C164.2 D15.1(K) DS6.2(A) JP5.2 R418.2 R419.2 U36.6(OUT)
EXP_12V: C159.2 U35.7(VIN)
GND: C159.1 C161.1 C162.1 C163.1 C164.1 C165.1 C166.1 C167.1 C188.1 D14.2(A) D15.2(A) R413.1 R414.2 R415.1 R420.1 R421.2 R422.1 R423.1 U35.6(GND) U35.9(POWERPAD) U36.8
eFUSE_ILIM_5V_TEC: R423.2 U36.9 ; off-sheet eFUSE_ILIM_5V_TEC
POW_ONOFF_BUCK_PERI: R411.2 R414.1 U35.5(ENA) ; off-sheet POW_ONOFF_BUCK_PERI
POW_ONOFF_TEC: R416.2 R421.1 U36.1(EN/UVLO) ; off-sheet POW_ONOFF_TEC
NetC158_1: C158.1 D14.1(K) L6.1 U35.8(PH)
NetC158_2: C158.2 U35.1(BOOT)
NetC166_2: C166.2 U36.10
NetC167_2: C167.2 U36.7
NetDS5_1: DS5.1(K) R413.2
NetDS6_1: DS6.1(K) R420.2
NetR412_1: R412.1 R415.2 U35.4(VSENSE)
NetR417_1: R417.1 R422.2 U36.2(OVLO/OVCSEL)
NetR418_1: R418.1 U36.3(PG/AUXOFF)
NetR419_1: R419.1 U36.4(PGTH/~{FLT})

Not connected (* = marked no-connect by the designer): U35 2(NC_2) 3(NC_3)

### Layout directives
net class POWER: 5V_PERI, 5V_TEC

### Notes on the sheet
- Undervoltage Protector: NONE
- Overvoltage Protector: 1.2*(133+470)/133=5.44V
- Slew Rate: 2000/2200=0.91V/ms
- I-LIM: 3334/1600=2.08A
- Project:
- Sub-system:
- Design by:
- Sheet title:
- Sheet
- of
- Checked by:
- Approved by:
- Revision:
- Document No:
- Size:
- Date:
- A3

### Library data of the parts
C158 C161 C165-C167 = _CAP_C_2: CAP
C159 C162-C164 C188 = _CAP_C_High_2: CAP High Value
D14 D15 = DIODE SCHOTTKY
JP5 = JUMPER
L6 = SRP7050TA-220M: FIXED IND 22UH 2.5A 170 MOHM SMD
R411-R423 = _RES_B_2: RES
U35 = TPS5430DDAR: IC REG BUCK ADJ 3A 8SOPWR

## Sheet 06_POWER_4.SchDoc
size 420 x 297 mm; SheetNumber: 10; SheetTotal: 36
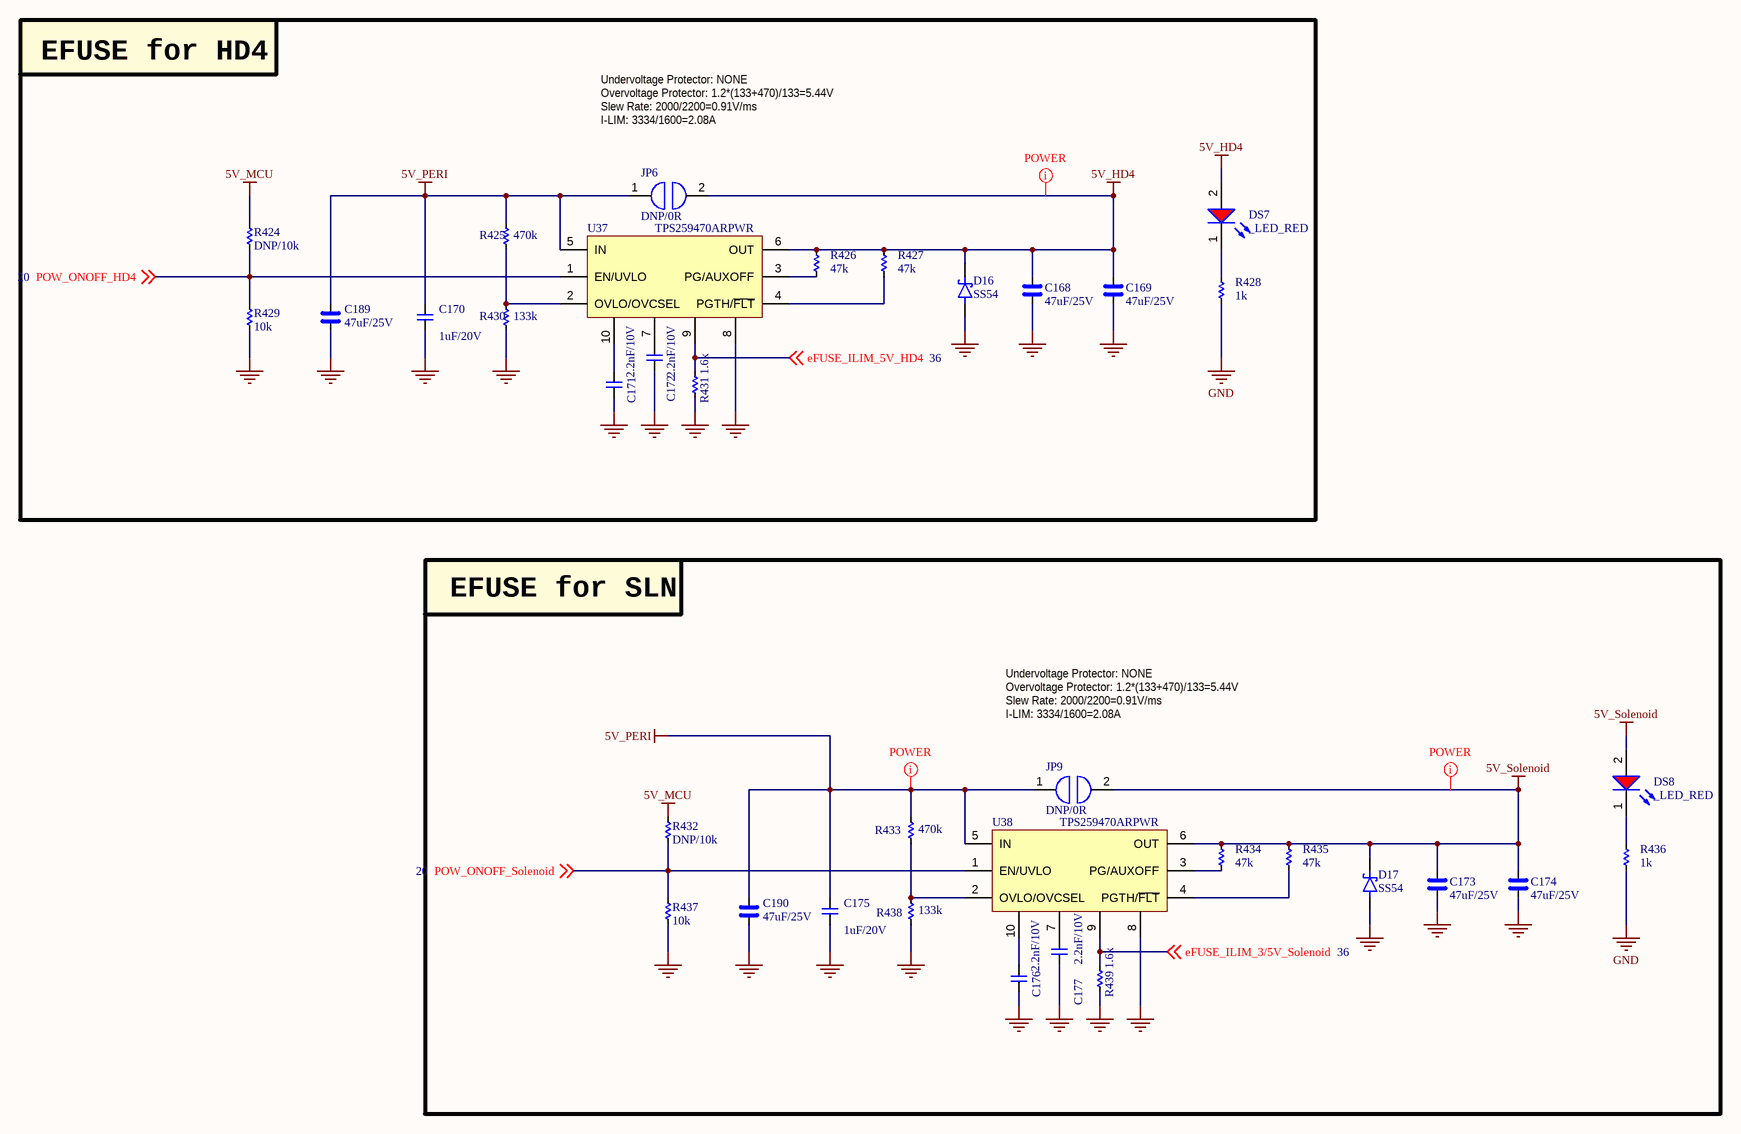
[diagram p8: 06_POWER_4.SchDoc]

### Parts
C168  47uF/25V  [CAP_C_3225X80]
C169  47uF/25V  [CAP_C_3225X80]
C170  1uF/20V  [CAP_C_1005X60]
C171  2.2nF/10V  [CAP_C_1005X60]
C172  2.2nF/10V  [CAP_C_1005X60]
C173  47uF/25V  [CAP_C_3225X80]
C174  47uF/25V  [CAP_C_3225X80]
C175  1uF/20V  [CAP_C_1005X60]
C176  2.2nF/10V  [CAP_C_1005X60]
C177  2.2nF/10V  [CAP_C_1005X60]
C189  47uF/25V  [CAP_C_3225X80]
C190  47uF/25V  [CAP_C_3225X80]
D16  SS54  [DO-214AC_SMA]
D17  SS54  [DO-214AC_SMA]
DS7  _LED_RED  [LED_0603]
DS8  _LED_RED  [LED_0603]
JP6  DNP/0R  [JUMPER_1608]
JP9  DNP/0R  [JUMPER_1608]
R424  DNP/10k  [RES_C_1005X40]
R425  470k  [RES_C_1005X40]
R426  47k  [RES_C_1005X40]
R427  47k  [RES_C_1005X40]
R428  1k  [RES_C_1005X40]
R429  10k  [RES_C_1005X40]
R430  133k  [RES_C_1005X40]
R431  1.6k  [RES_C_1005X40]
R432  DNP/10k  [RES_C_1005X40]
R433  470k  [RES_C_1005X40]
R434  47k  [RES_C_1005X40]
R435  47k  [RES_C_1005X40]
R436  1k  [RES_C_1005X40]
R437  10k  [RES_C_1005X40]
R438  133k  [RES_C_1005X40]
R439  1.6k  [RES_C_1005X40]
U37  TPS259470ARPWR  [VQFN-HR-10]
U38  TPS259470ARPWR  [VQFN-HR-10]

### Blocks framed on the sheet
EFUSE for HD4: C168-C172 C189 D16 DS7 JP6 R424-R431 U37
EFUSE for SLN: C173-C177 C190 D17 DS8 JP9 R432-R439 U38

### Nets
5V_HD4: C168.2 C169.2 D16.1(K) DS7.2(A) JP6.2 R426.2 R427.2 U37.6(OUT)
5V_MCU: R424.1 R432.1
5V_PERI: C170.2 C175.2 C189.2 C190.2 JP6.1 JP9.1 R425.2 R433.2 U37.5(IN) U38.5(IN)
5V_Solenoid: C173.2 C174.2 D17.1(K) DS8.2(A) JP9.2 R434.2 R435.2 U38.6(OUT)
GND: C168.1 C169.1 C170.1 C171.1 C172.1 C173.1 C174.1 C175.1 C176.1 C177.1 C189.1 C190.1 D16.2(A) D17.2(A) R428.1 R429.2 R430.1 R431.1 R436.1 R437.2 R438.1 R439.1 U37.8 U38.8
eFUSE_ILIM_3/5V_Solenoid: R439.2 U38.9 ; off-sheet eFUSE_ILIM_3/5V_Solenoid
eFUSE_ILIM_5V_HD4: R431.2 U37.9 ; off-sheet eFUSE_ILIM_5V_HD4
POW_ONOFF_HD4: R424.2 R429.1 U37.1(EN/UVLO) ; off-sheet POW_ONOFF_HD4
POW_ONOFF_Solenoid: R432.2 R437.1 U38.1(EN/UVLO) ; off-sheet POW_ONOFF_Solenoid
NetC171_2: C171.2 U37.10
NetC172_2: C172.2 U37.7
NetC176_2: C176.2 U38.10
NetC177_2: C177.2 U38.7
NetDS7_1: DS7.1(K) R428.2
NetDS8_1: DS8.1(K) R436.2
NetR425_1: R425.1 R430.2 U37.2(OVLO/OVCSEL)
NetR426_1: R426.1 U37.3(PG/AUXOFF)
NetR427_1: R427.1 U37.4(PGTH/~{FLT})
NetR433_1: R433.1 R438.2 U38.2(OVLO/OVCSEL)
NetR434_1: R434.1 U38.3(PG/AUXOFF)
NetR435_1: R435.1 U38.4(PGTH/~{FLT})

### Layout directives
net class POWER: 5V_HD4, 5V_PERI, 5V_Solenoid

### Notes on the sheet
- Undervoltage Protector: NONE
- Overvoltage Protector: 1.2*(133+470)/133=5.44V
- Slew Rate: 2000/2200=0.91V/ms
- I-LIM: 3334/1600=2.08A
- Project:
- Sub-system:
- Design by:
- Sheet title:
- Sheet
- of
- Checked by:
- Approved by:
- Revision:
- Document No:
- Size:
- Date:
- A3

### Library data of the parts
C168 C169 C173 C174 C189 C190 = _CAP_C_High_2: CAP High Value
C170-C172 C175-C177 = _CAP_C_2: CAP
D16 D17 = DIODE SCHOTTKY
JP6 JP9 = JUMPER
R424-R439 = _RES_B_2: RES

## Sheet 06_POWER_5.SchDoc
size 420 x 297 mm; SheetNumber: 11; SheetTotal: 35
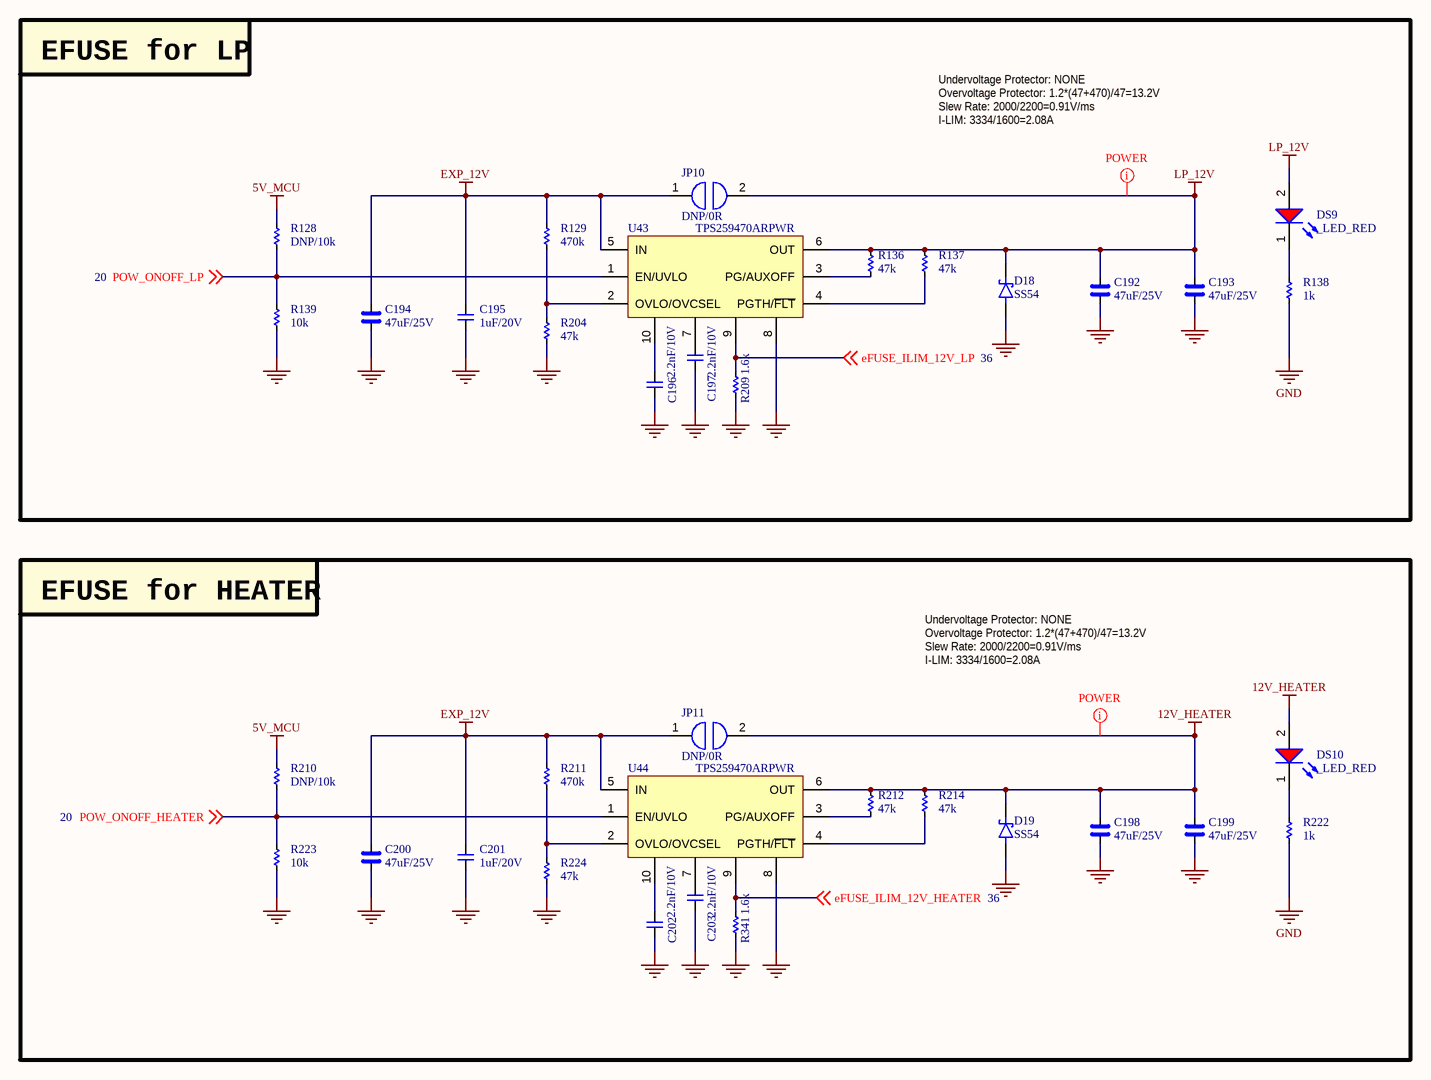
[diagram p9: 06_POWER_5.SchDoc]

### Parts
C192  47uF/25V  [CAP_C_3225X80]
C193  47uF/25V  [CAP_C_3225X80]
C194  47uF/25V  [CAP_C_3225X80]
C195  1uF/20V  [CAP_C_1005X60]
C196  2.2nF/10V  [CAP_C_1005X60]
C197  2.2nF/10V  [CAP_C_1005X60]
C198  47uF/25V  [CAP_C_3225X80]
C199  47uF/25V  [CAP_C_3225X80]
C200  47uF/25V  [CAP_C_3225X80]
C201  1uF/20V  [CAP_C_1005X60]
C202  2.2nF/10V  [CAP_C_1005X60]
C203  2.2nF/10V  [CAP_C_1005X60]
D18  SS54  [DO-214AC_SMA]
D19  SS54  [DO-214AC_SMA]
DS9  _LED_RED  [LED_0603]
DS10  _LED_RED  [LED_0603]
JP10  DNP/0R  [JUMPER_1608]
JP11  DNP/0R  [JUMPER_1608]
R128  DNP/10k  [RES_C_1005X40]
R129  470k  [RES_C_1005X40]
R136  47k  [RES_C_1005X40]
R137  47k  [RES_C_1005X40]
R138  1k  [RES_C_1005X40]
R139  10k  [RES_C_1005X40]
R204  47k  [RES_C_1005X40]
R209  1.6k  [RES_C_1005X40]
R210  DNP/10k  [RES_C_1005X40]
R211  470k  [RES_C_1005X40]
R212  47k  [RES_C_1005X40]
R214  47k  [RES_C_1005X40]
R222  1k  [RES_C_1005X40]
R223  10k  [RES_C_1005X40]
R224  47k  [RES_C_1005X40]
R341  1.6k  [RES_C_1005X40]
U43  TPS259470ARPWR  [VQFN-HR-10]
U44  TPS259470ARPWR  [VQFN-HR-10]

### Blocks framed on the sheet
EFUSE for LP: C192-C197 D18 DS9 JP10 R128 R129 R136-R139 R204 R209 U43
EFUSE for HEATER: C198-C203 D19 DS10 JP11 R210-R212 R214 R222-R224 R341 U44

### Nets
5V_MCU: R128.1 R210.1
12V_HEATER: C198.2 C199.2 D19.1(K) DS10.2(A) JP11.2 R212.2 R214.2 U44.6(OUT)
EXP_12V: C194.2 C195.2 C200.2 C201.2 JP10.1 JP11.1 R129.2 R211.2 U43.5(IN) U44.5(IN)
GND: C192.1 C193.1 C194.1 C195.1 C196.1 C197.1 C198.1 C199.1 C200.1 C201.1 C202.1 C203.1 D18.2(A) D19.2(A) R138.1 R139.2 R204.1 R209.1 R222.1 R223.2 R224.1 R341.1 U43.8 U44.8
LP_12V: C192.2 C193.2 D18.1(K) DS9.2(A) JP10.2 R136.2 R137.2 U43.6(OUT)
eFUSE_ILIM_12V_HEATER: R341.2 U44.9 ; off-sheet eFUSE_ILIM_12V_HEATER
eFUSE_ILIM_12V_LP: R209.2 U43.9 ; off-sheet eFUSE_ILIM_12V_LP
POW_ONOFF_HEATER: R210.2 R223.1 U44.1(EN/UVLO) ; off-sheet POW_ONOFF_HEATER
POW_ONOFF_LP: R128.2 R139.1 U43.1(EN/UVLO) ; off-sheet POW_ONOFF_LP
NetC196_2: C196.2 U43.10
NetC197_2: C197.2 U43.7
NetC202_2: C202.2 U44.10
NetC203_2: C203.2 U44.7
NetDS9_1: DS9.1(K) R138.2
NetDS10_1: DS10.1(K) R222.2
NetR129_1: R129.1 R204.2 U43.2(OVLO/OVCSEL)
NetR136_1: R136.1 U43.3(PG/AUXOFF)
NetR137_1: R137.1 U43.4(PGTH/~{FLT})
NetR211_1: R211.1 R224.2 U44.2(OVLO/OVCSEL)
NetR212_1: R212.1 U44.3(PG/AUXOFF)
NetR214_1: R214.1 U44.4(PGTH/~{FLT})

### Layout directives
net class POWER: 12V_HEATER, LP_12V

### Notes on the sheet
- Undervoltage Protector: NONE
- Overvoltage Protector: 1.2*(47+470)/47=13.2V
- Slew Rate: 2000/2200=0.91V/ms
- I-LIM: 3334/1600=2.08A
- Project:
- Sub-system:
- Design by:
- Sheet title:
- Sheet
- of
- Checked by:
- Approved by:
- Revision:
- Document No:
- Size:
- Date:
- A3

### Library data of the parts
C192-C194 C198-C200 = _CAP_C_High_2: CAP High Value
C195-C197 C201-C203 = _CAP_C_2: CAP
D18 D19 = DIODE SCHOTTKY
JP10 JP11 = JUMPER
R128 R129 R136-R139 R204 R209-R212 R214 R222-R224 R341 = _RES_B_2: RES

## Sheet 07_CAN.SchDoc
size 420 x 297 mm; SheetNumber: 12; SheetTotal: 36
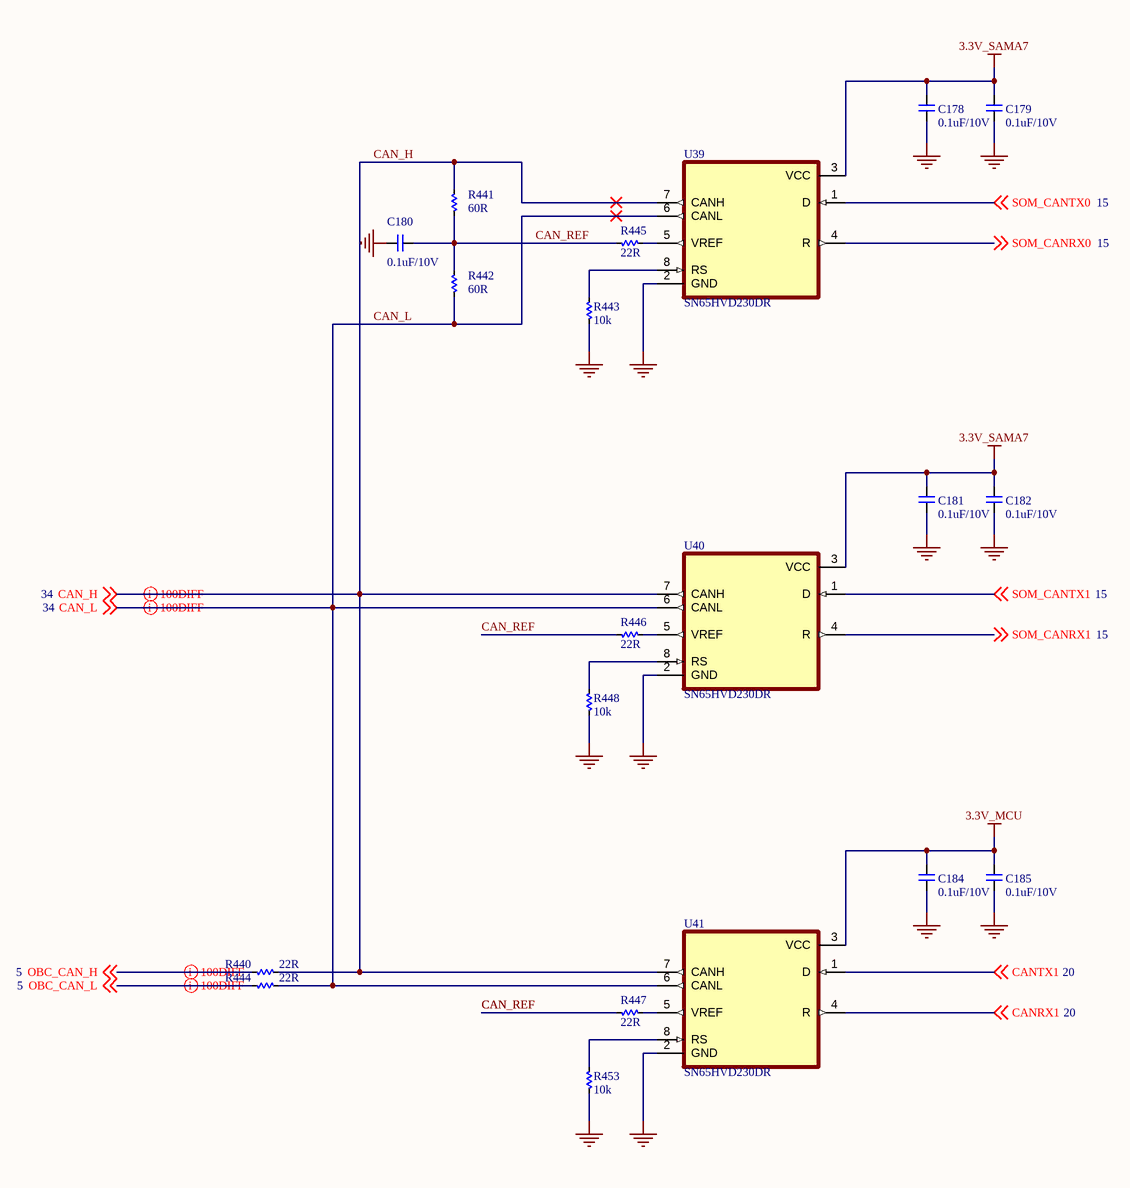
[diagram p10: 07_CAN.SchDoc]

### Parts
C178  0.1uF/10V  [CAP_C_1005X60]
C179  0.1uF/10V  [CAP_C_1005X60]
C180  0.1uF/10V  [CAP_C_1005X60]
C181  0.1uF/10V  [CAP_C_1005X60]
C182  0.1uF/10V  [CAP_C_1005X60]
C184  0.1uF/10V  [CAP_C_1005X60]
C185  0.1uF/10V  [CAP_C_1005X60]
R440  22R  [RES_C_1005X40]
R441  60R  [RES_C_1005X40]
R442  60R  [RES_C_1005X40]
R443  10k  [RES_C_1005X40]
R444  22R  [RES_C_1005X40]
R445  22R  [RES_C_1005X40]
R446  22R  [RES_C_1005X40]
R447  22R  [RES_C_1005X40]
R448  10k  [RES_C_1005X40]
R453  10k  [RES_C_1005X40]
U39  SN65HVD230DR  [SOIC127P599X175-8N]
U40  SN65HVD230DR  [SOIC127P599X175-8N]
U41  SN65HVD230DR  [SOIC127P599X175-8N]

### Nets
3.3V_MCU: C184.1 C185.1 U41.3(VCC)
3.3V_SAMA7: C178.1 C179.1 C181.1 C182.1 U39.3(VCC) U40.3(VCC)
GND: C178.2 C179.2 C180.2 C181.2 C182.2 C184.2 C185.2 R443.1 R448.1 R453.1 U39.2(GND) U40.2(GND) U41.2(GND)
CAN_H: R440.2 R441.2 U39.7(CANH) U40.7(CANH) U41.7(CANH) ; off-sheet CAN_H
CAN_L: R442.1 R444.2 U39.6(CANL) U40.6(CANL) U41.6(CANL) ; off-sheet CAN_L
CAN_REF: C180.1 R441.1 R442.2 R445.1 R446.1 R447.1
CANRX1: U41.4(R) ; off-sheet CANRX1
CANTX1: U41.1(D) ; off-sheet CANTX1
OBC_CAN_H: R440.1 ; off-sheet OBC_CAN_H
OBC_CAN_L: R444.1 ; off-sheet OBC_CAN_L
SOM_CANRX0: U39.4(R) ; off-sheet SOM_CANRX0
SOM_CANRX1: U40.4(R) ; off-sheet SOM_CANRX1
SOM_CANTX0: U39.1(D) ; off-sheet SOM_CANTX0
SOM_CANTX1: U40.1(D) ; off-sheet SOM_CANTX1
NetR443_2: R443.2 U39.8(RS)
NetR445_2: R445.2 U39.5(VREF)
NetR446_2: R446.2 U40.5(VREF)
NetR447_2: R447.2 U41.5(VREF)
NetR448_2: R448.2 U40.8(RS)
NetR453_2: R453.2 U41.8(RS)

### Layout directives
differential pair; differential pair class DIFF100: CAN_H, CAN_L, OBC_CAN_H, OBC_CAN_L

### Notes on the sheet
- Project:
- Sub-system:
- Design by:
- Sheet title:
- Sheet
- of
- Checked by:
- Approved by:
- Revision:
- Document No:
- Size:
- Date:
- A3

### Library data of the parts
C178-C182 C184 C185 = _CAP_C_2: CAP
R440-R448 R453 = _RES_B_2: RES
U39-U41 = SN65HVD230DR: 3.3 V CAN Transceiver with Standby Mode; MF: Texas Instruments; SnapEDA_Link: https://www.snapeda.com/parts/SN65HVD230DR/Texas+Instruments/view-part/?ref=snap; Package: SOIC-8 Texas Instruments; Value: *; MP: SN65HVD230DR; Check_prices: https://www.snapeda.com/parts/SN65HVD230DR/Texas+Instruments/view-part/?ref=eda

## Sheet 08_SAMA7G54-MPU.SchDoc
size 420 x 297 mm; SheetNumber: 13; SheetTotal: 36
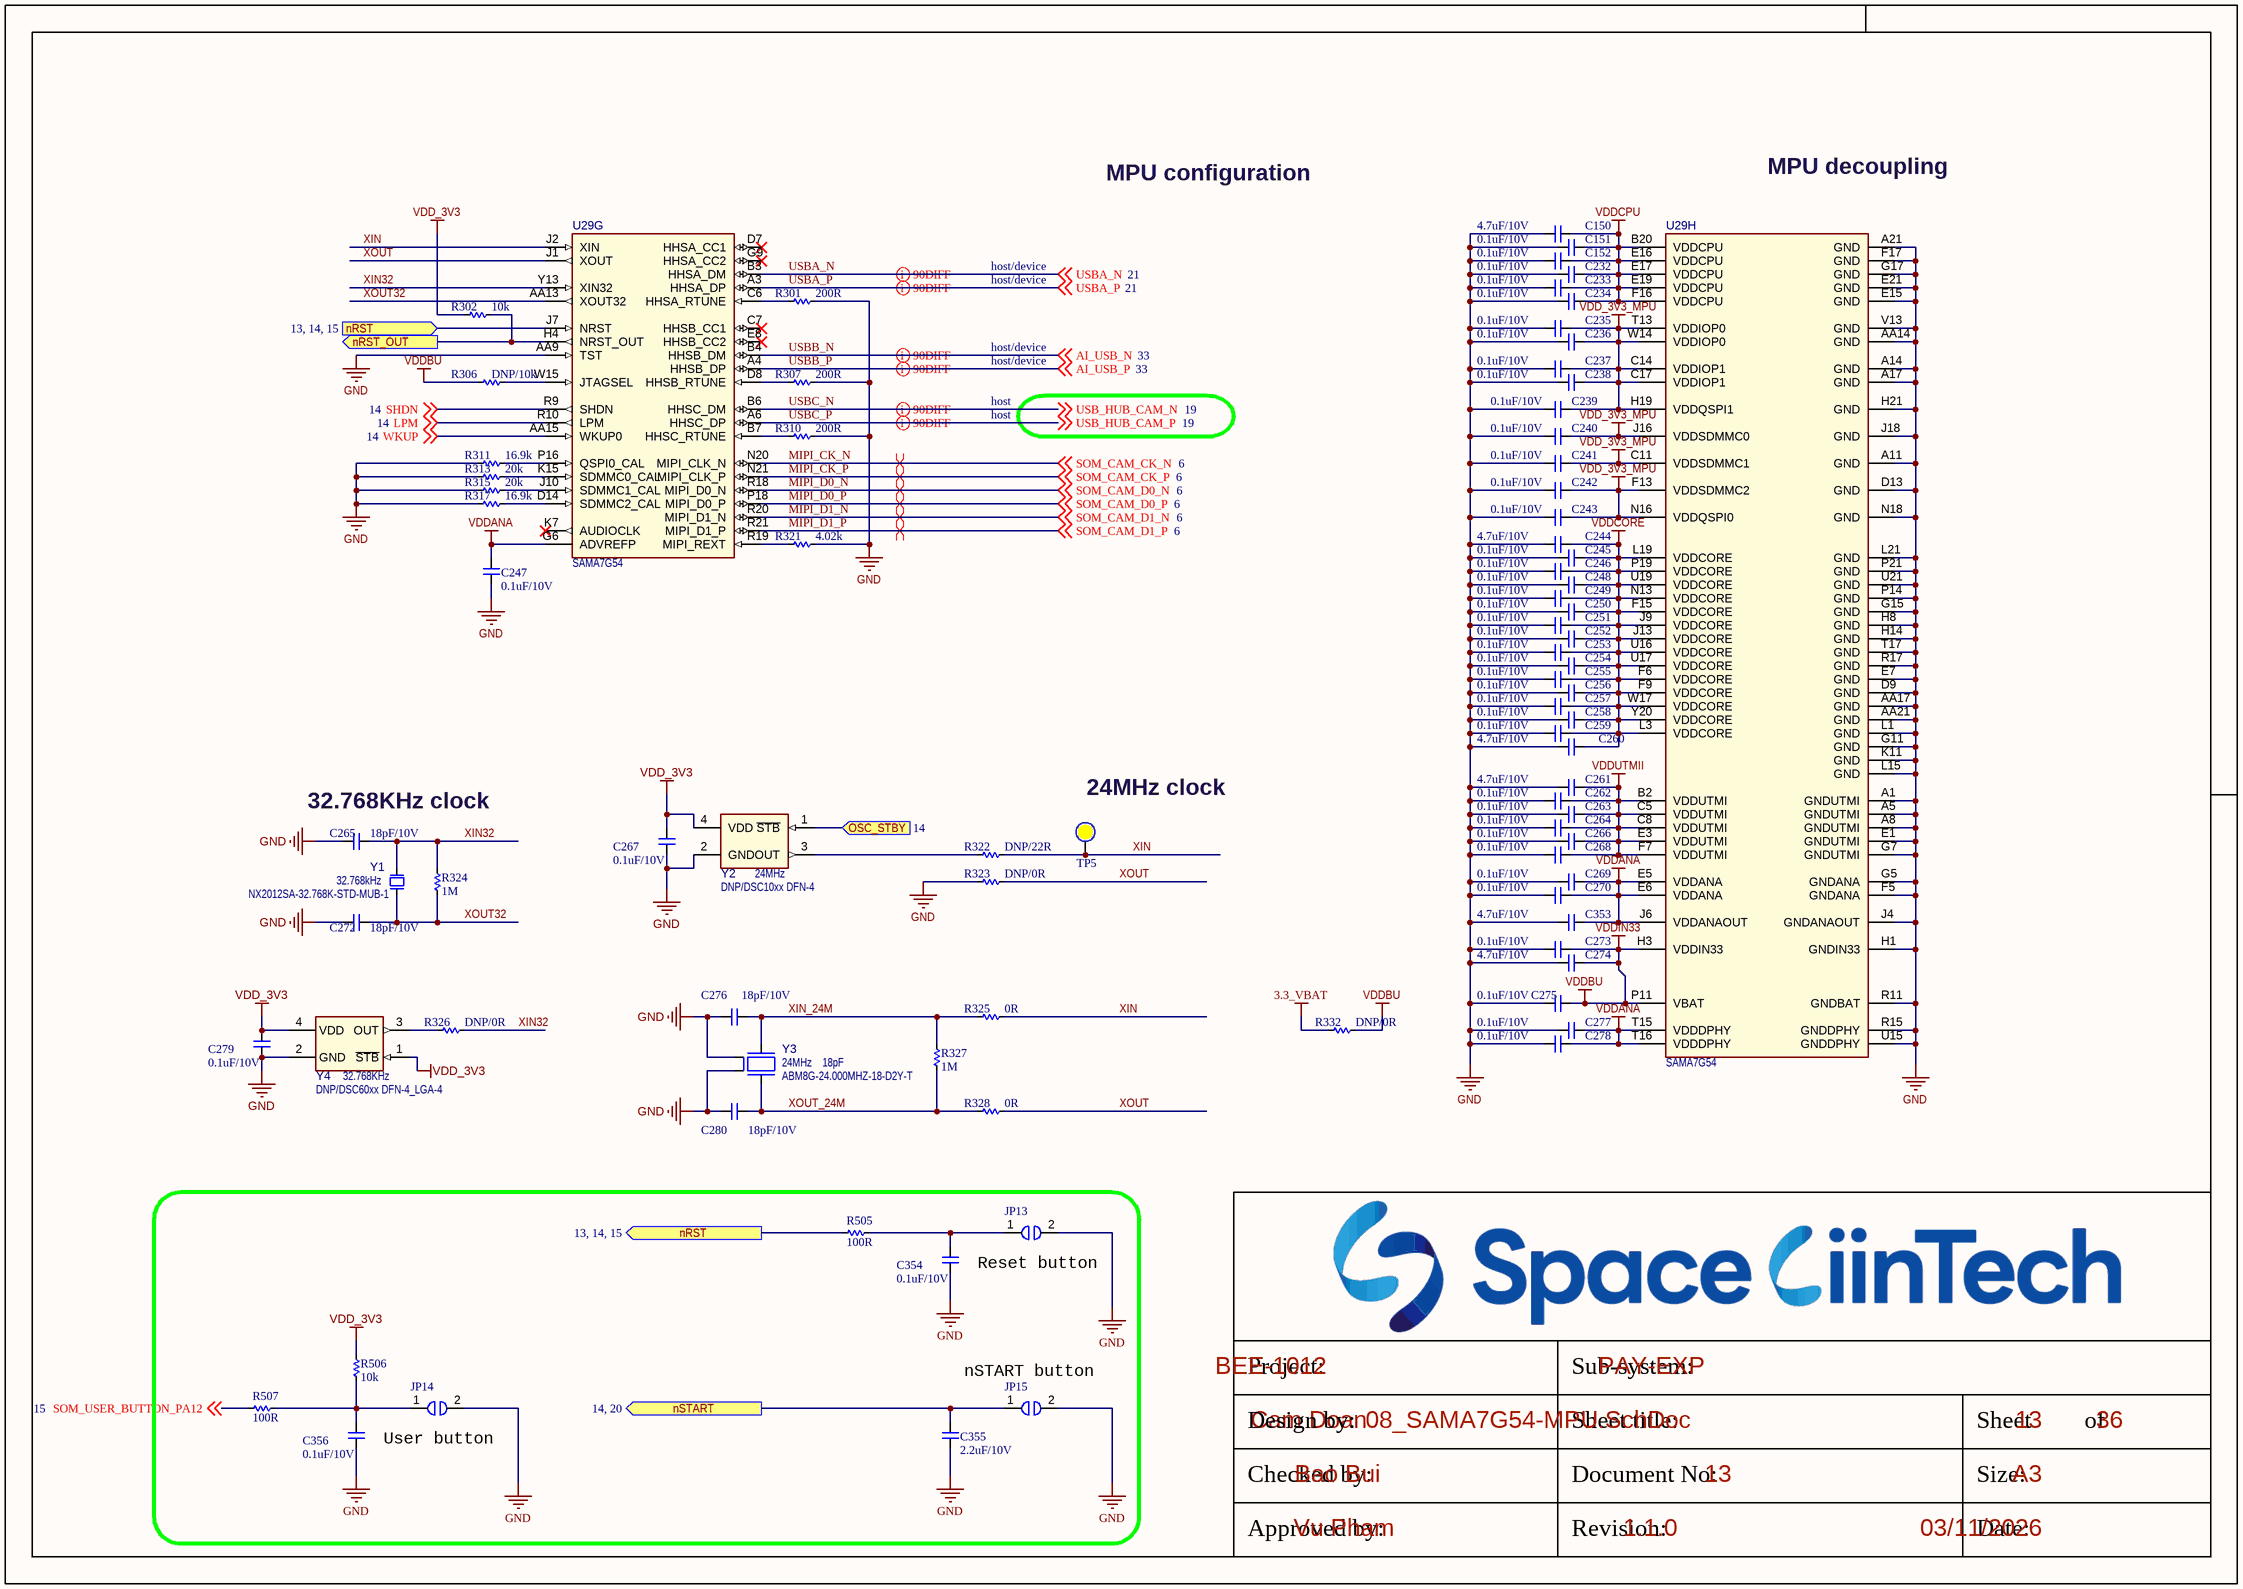
[diagram p11: 08_SAMA7G54-MPU.SchDoc]

### Parts
C150  4.7uF/10V  [CAP_C_1005X50_L]
C151  0.1uF/10V  [CAP_C_0603x30]
C152  0.1uF/10V  [CAP_C_0603x30]
C232  0.1uF/10V  [CAP_C_0603x30]
C233  0.1uF/10V  [CAP_C_0603x30]
C234  0.1uF/10V  [CAP_C_0603x30]
C235  0.1uF/10V  [CAP_C_0603x30]
C236  0.1uF/10V  [CAP_C_0603x30]
C237  0.1uF/10V  [CAP_C_0603x30]
C238  0.1uF/10V  [CAP_C_0603x30]
C239  0.1uF/10V  [CAP_C_0603x30]
C240  0.1uF/10V  [CAP_C_0603x30]
C241  0.1uF/10V  [CAP_C_0603x30]
C242  0.1uF/10V  [CAP_C_0603x30]
C243  0.1uF/10V  [CAP_C_0603x30]
C244  4.7uF/10V  [CAP_C_1005X50_L]
C245  0.1uF/10V  [CAP_C_0603x30]
C246  0.1uF/10V  [CAP_C_0603x30]
C247  0.1uF/10V  [CAP_C_0603x30]
C248  0.1uF/10V  [CAP_C_0603x30]
C249  0.1uF/10V  [CAP_C_0603x30]
C250  0.1uF/10V  [CAP_C_0603x30]
C251  0.1uF/10V  [CAP_C_0603x30]
C252  0.1uF/10V  [CAP_C_0603x30]
C253  0.1uF/10V  [CAP_C_0603x30]
C254  0.1uF/10V  [CAP_C_0603x30]
C255  0.1uF/10V  [CAP_C_0603x30]
C256  0.1uF/10V  [CAP_C_0603x30]
C257  0.1uF/10V  [CAP_C_0603x30]
C258  0.1uF/10V  [CAP_C_0603x30]
C259  0.1uF/10V  [CAP_C_0603x30]
C260  4.7uF/10V  [CAP_C_1005X50_L]
C261  4.7uF/10V  [CAP_C_1005X50_L]
C262  0.1uF/10V  [CAP_C_0603x30]
C263  0.1uF/10V  [CAP_C_0603x30]
C264  0.1uF/10V  [CAP_C_0603x30]
C265  18pF/10V  [CAP_C_1005X60]
C266  0.1uF/10V  [CAP_C_0603x30]
C267  0.1uF/10V  [CAP_C_1005X60]
C268  0.1uF/10V  [CAP_C_0603x30]
C269  0.1uF/10V  [CAP_C_0603x30]
C270  0.1uF/10V  [CAP_C_0603x30]
C272  18pF/10V  [CAP_C_1005X60]
C273  0.1uF/10V  [CAP_C_0603x30]
C274  4.7uF/10V  [CAP_C_1005X50_L]
C275  0.1uF/10V  [CAP_C_0603x30]
C276  18pF/10V  [CAP_C_1005X60]
C277  0.1uF/10V  [CAP_C_0603x30]
C278  0.1uF/10V  [CAP_C_0603x30]
C279  0.1uF/10V  [CAP_C_1005X60]
C280  18pF/10V  [CAP_C_1005X60]
C353  4.7uF/10V  [CAP_C_1005X50_L]
C354  0.1uF/10V  [CAP_C_1005X60]
C355  2.2uF/10V  [CAP_C_1005X60]
C356  0.1uF/10V  [CAP_C_1005X60]
JP13  (no value)  [TESTPOINT_SHORT_120X100_60]
JP14  (no value)  [TESTPOINT_SHORT_120X100_60]
JP15  (no value)  [TESTPOINT_SHORT_120X100_60]
R301  200R  [RES_C_0603X30]
R302  10k  [RES_C_1005X40]
R306  DNP/10k  [RES_C_0603X30]
R307  200R  [RES_C_0603X30]
R310  200R  [RES_C_0603X30]
R311  16.9k  [RES_C_0603X30]
R313  20k  [RES_C_1005X40]
R315  20k  [RES_C_0603X30]
R317  16.9k  [RES_C_0603X30]
R321  4.02k  [RES_C_1005X40]
R322  DNP/22R  [RES_C_1005X40]
R323  DNP/0R  [RES_C_1005X40]
R324  1M  [RES_C_1005X40]
R325  0R  [RES_C_1005X40]
R326  DNP/0R  [RES_C_1005X40]
R327  1M  [RES_C_1005X40]
R328  0R  [RES_C_1005X40]
R332  DNP/0R  [RES_C_1005X40]
R505  100R  [RES_C_1005X40]
R506  10k  [RES_C_1005X40]
R507  100R  [RES_C_1005X40]
TP5  (no value)  [Testpoint_80]  (no BOM)
U29  SAMA7G54  [TFBGA-343_14x14 - 2.5mm]  (parts G,H of 8)
Y1  value 32.768kHz  Manufacturer Part Number 1: NX2012SA-32.768K-STD-MUB-1  [CRYSTAL_NX2012SA]  (hidden comment: Crystal 2 Pins)
Y2  DNP/DSC10xx DFN-4  value 24MHz  [DFN-4_2.5x2]
Y3  value 24MHz  Load Capacitance: 18pF  Manufacturer Part Number 1: ABM8G-24.000MHZ-18-D2Y-T  [CRYSTAL_ABM8G]  (hidden comment: Crystal 4 Pins)
Y4  DNP/DSC60xx DFN-4_LGA-4  value 32.768KHz  [DFN-4_2x1.6]

### Ports
nRST (in, see 13, 14, 15), nRST (out, see 13, 14, 15), nRST_OUT (out), nSTART (out, see 14, 20), OSC_STBY (in, see 14)

### Nets
3.3_VBAT: R332.1
GND: C150.2 C151.2 C152.2 C232.2 C233.2 C234.2 C235.2 C236.2 C237.2 C238.2 C239.2 C240.2 C241.2 C242.2 C243.2 C244.2 C245.2 C246.2 C247.1 C248.2 C249.2 C250.2 C251.2 C252.2 C253.2 C254.2 C255.2 C256.2 C257.2 C258.2 C259.2 C260.2 C261.2 C262.2 C263.2 C264.2 C265.2 C266.2 C267.1 C268.2 C269.2 C270.2 C272.2 C273.2 C274.2 C275.2 C276.2 C277.2 C278.2 C279.1 C280.2 C353.2 C354.1 C355.2 C356.1 JP13.2 JP14.2 JP15.2 R301.1 R307.1 R310.1 R311.2 R313.2 R315.2 R317.2 R321.1 R323.1 U29.A1(GNDUTMI) U29.A5(GNDUTMI) U29.A8(GNDUTMI) U29.A11(GND) U29.A14(GND) U29.A17(GND) U29.A21(GND) U29.AA9(TST) U29.AA14(GND) U29.AA17(GND) U29.AA21(GND) U29.D9(GND) U29.D13(GND) U29.E1(GNDUTMI) U29.E7(GND) U29.E15(GND) U29.E21(GND) U29.F5(GNDANA) U29.F17(GND) U29.G5(GNDANA) U29.G7(GNDUTMI) U29.G11(GND) U29.G15(GND) U29.G17(GND) U29.H1(GNDIN33) U29.H8(GND) U29.H14(GND) U29.H21(GND) U29.J4(GNDANAOUT) U29.J18(GND) U29.K11(GND) U29.L1(GND) U29.L15(GND) U29.L21(GND) U29.N18(GND) U29.P14(GND) U29.P21(GND) U29.R11(GNDBAT) U29.R15(GNDDPHY) U29.R17(GND) U29.T17(GND) U29.U15(GNDDPHY) U29.U21(GND) U29.V13(GND) Y2.2(GND) Y3.2(GND) Y3.4(GND) Y4.2(GND)
VDD_3V3: C267.2 C279.2 R302.2 R506.2 Y2.4(VDD) Y4.1(~{STB}) Y4.4(VDD)
VDD_3V3_MPU: C235.1 C236.1 C237.1 C238.1 C239.1 C240.1 C241.1 C242.1 C243.1 C261.1 C262.1 C263.1 C264.1 C266.1 C268.1 C273.1 C274.1 C275.1 R306.2 R332.2 U29.B2(VDDUTMI) U29.C5(VDDUTMI) U29.C8(VDDUTMI) U29.C11(VDDSDMMC1) U29.C14(VDDIOP1) U29.C17(VDDIOP1) U29.E3(VDDUTMI) U29.F7(VDDUTMI) U29.F13(VDDSDMMC2) U29.H3(VDDIN33) U29.H19(VDDQSPI1) U29.J16(VDDSDMMC0) U29.N16(VDDQSPI0) U29.P11(VBAT) U29.T13(VDDIOP0) U29.W14(VDDIOP0)  [also labelled VDDBU, VDDIN33, VDDUTMII]
VDDANA: C247.2 C269.1 C270.1 C277.1 C278.1 C353.1 U29.E5(VDDANA) U29.E6(VDDANA) U29.G6(ADVREFP) U29.J6(VDDANAOUT) U29.T15(VDDDPHY) U29.T16(VDDDPHY)
VDDCORE: C244.1 C245.1 C246.1 C248.1 C249.1 C250.1 C251.1 C252.1 C253.1 C254.1 C255.1 C256.1 C257.1 C258.1 C259.1 C260.1 U29.F6(VDDCORE) U29.F9(VDDCORE) U29.F15(VDDCORE) U29.J9(VDDCORE) U29.J13(VDDCORE) U29.L3(VDDCORE) U29.L19(VDDCORE) U29.N13(VDDCORE) U29.P19(VDDCORE) U29.U16(VDDCORE) U29.U17(VDDCORE) U29.U19(VDDCORE) U29.W17(VDDCORE) U29.Y20(VDDCORE)
VDDCPU: C150.1 C151.1 C152.1 C232.1 C233.1 C234.1 U29.B20(VDDCPU) U29.E16(VDDCPU) U29.E17(VDDCPU) U29.E19(VDDCPU) U29.F16(VDDCPU)
CPU_WD_nRESET: R505.1 U29.J7(NRST) ; port nRST
LPM: U29.R10(LPM) ; off-sheet LPM
MIPI_CK_N: U29.N20(MIPI_CLK_N) ; off-sheet SOM_CAM_CK_N  [also labelled SOM_CAM_CK_N]
MIPI_CK_P: U29.N21(MIPI_CLK_P) ; off-sheet SOM_CAM_CK_P  [also labelled SOM_CAM_CK_P]
MIPI_D0_N: U29.R18(MIPI_D0_N) ; off-sheet SOM_CAM_D0_N  [also labelled SOM_CAM_D0_N]
MIPI_D0_P: U29.P18(MIPI_D0_P) ; off-sheet SOM_CAM_D0_P  [also labelled SOM_CAM_D0_P]
MIPI_D1_N: U29.R20(MIPI_D1_N) ; off-sheet SOM_CAM_D1_N  [also labelled SOM_CAM_D1_N]
MIPI_D1_P: U29.R21(MIPI_D1_P) ; off-sheet SOM_CAM_D1_P  [also labelled SOM_CAM_D1_P]
SHDN: U29.R9(SHDN) ; off-sheet SHDN
SOM_USER_BUTTON_PA12: R507.1 ; off-sheet SOM_USER_BUTTON_PA12
USBA_N: U29.B3(HHSA_DM) ; off-sheet USBA_N
USBA_P: U29.A3(HHSA_DP) ; off-sheet USBA_P
USBB_N: U29.B4(HHSB_DM) ; off-sheet AI_USB_N  [also labelled AI_USB_N]
USBB_P: U29.A4(HHSB_DP) ; off-sheet AI_USB_P  [also labelled AI_USB_P]
USBC_N: U29.B6(HHSC_DM) ; off-sheet USB_HUB_CAM_N  [also labelled USB_HUB_CAM_N]
USBC_P: U29.A6(HHSC_DP) ; off-sheet USB_HUB_CAM_P  [also labelled USB_HUB_CAM_P]
WKUP: U29.AA15(WKUP0) ; off-sheet WKUP
XIN: R322.2 R325.2 TP5.1 U29.J2(XIN)
XIN32: C265.1 R324.1 R326.2 U29.Y13(XIN32) Y1.2(Osc2)
XIN_24M: C276.1 R325.1 R327.2 Y3.3(Osc2)
XOUT: R323.2 R328.2 U29.J1(XOUT)
XOUT32: C272.1 R324.2 U29.AA13(XOUT32) Y1.1(Osc1)
XOUT_24M: C280.1 R327.1 R328.1 Y3.1(Osc1)
NetC354_2: C354.2 JP13.1 R505.2
NetC355_1: C355.1 JP15.1 ; port nSTART
NetC356_2: C356.2 JP14.1 R506.1 R507.2
NetQ27_3: Y2.1(~{STB}) ; port OSC_STBY
NetR301_2: R301.2 U29.C6(HHSA_RTUNE)
NetR302_1: R302.1 U29.H4(NRST_OUT) ; port nRST_OUT
NetR306_1: R306.1 U29.W15(JTAGSEL)
NetR307_2: R307.2 U29.D8(HHSB_RTUNE)
NetR310_2: R310.2 U29.B7(HHSC_RTUNE)
NetR311_1: R311.1 U29.P16(QSPI0_CAL)
NetR313_1: R313.1 U29.K15(SDMMC0_CAL)
NetR315_1: R315.1 U29.J10(SDMMC1_CAL)
NetR317_1: R317.1 U29.D14(SDMMC2_CAL)
NetR321_2: R321.2 U29.R19(MIPI_REXT)
NetR322_1: R322.1 Y2.3(OUT)
NetR326_1: R326.1 Y4.3(OUT)

Not connected (* = marked no-connect by the designer): U29 C7(HHSB_CC1)* D7(HHSA_CC1)* E8(HHSB_CC2)* G9(HHSA_CC2)* K7(AUDIOCLK)*

### Layout directives
differential pair; differential pair class DIFF90; net class DIFF90: USBA_N, USBA_P, USBB_N, USBB_P, USBC_N, USBC_P
differential pair; net class DIFF100; differential pair class DIFF100: MIPI_CK_N, MIPI_CK_P, MIPI_D0_N, MIPI_D0_P, MIPI_D1_N, MIPI_D1_P

### Notes on the sheet
- MPU configuration
- MPU decoupling
- host/device
- host
- (near C265) 32.768KHz clock
- (near TP5) 24MHz clock
- Reset button
- (near JP15) nSTART button
- User button
- Project:
- Sub-system:
- Design by:
- Sheet title:
- Sheet
- of
- Checked by:
- Approved by:
- Revision:
- Document No:
- Size:
- Date:
- A3

### Library data of the parts
C150-C152 C232-C270 C272-C280 = _CAP_C_2: CAP
C353-C356 = _CAP_C_2: CAP CHIP
JP13-JP15 = JUMPER_1_1
R301 R302 R306 R307 R310 R311 R313 R315 R317 R321-R328 R332 R505-R507 = _RES_B_2: RES
TP5 = Test Point: Solder: NF
U29 = SAMA7G54: SAMA7G54 MPU 1000MHz Cortex-A7 TFBGA-343; Manufacturer Part Number 1: SAMA7G54-V/4HB; Manufacturer 1: Microchip; Description_: MCHP MPU 32-BIT Cortex-A7 1000MHz 128kB SAMA7G54-V/4HB TFBGA-343; Populated: YES; MCHP-ID: MIC8923; Symbol: SAMA7G54 TFBGA-343; Dev Tools Status: Design; Owner: Ciprian Abramov; Package: TFBGA-343; Value: SAMA7G54; Type: 32-Bit MPU; Status: MCL Design; Revision: 1; Category: MCHP-Microcontroller; ComponentLink1Description: SVN Datasheet; ComponentLink2Description: Local Datasheet; ComponentLink3URL: C:\ALTIUM_WORK\00001_MCHP-CDB\Library\LibraryRefs\SAMA7G54 TFBGA-343.SchLib; ComponentLink3Description: Open Symbol; ComponentLink4URL: C:\ALTIUM_WORK\00001_MCHP-CDB\Library\Footprints\TFBGA-343_14x14.PcbLib; ComponentLink4Description: Open Footprint; ComponentLink5Description: Open Footprint 2; ComponentLink6Description: Open Footprint 3; ComponentLink7Description: Open Footprint 4; Supplier 1: Microchip; Supplier Part Number 1: SAMA7G54-V/4HB; Quantity Override: 1
Y1 = OSC_32.768kHz: Crystal; Manufacturer 1: NDK; MCHP-ID: OSC1092; Description_: CRYSTAL 32.768kHz 12.5pF SMD NX2012SA; Dev Tools Status: Production; Owner: Jamus Griego; Tolerance: ±20ppm; Load Capacitance: 12.5pF; Populated: YES; Revision: 1; Symbol: Crystal 2 Pins; Status: MCL Design; ComponentLink1URL: https://chn-vm-apps.microchip.com/mchprepo/parts/Datasheets/c_NX2012SA-STD-MUB-1_e.pdf; ComponentLink1Description: SVN Datasheet; ComponentLink2URL: C:\ALTIUM_WORK\00001_MCHP-CDB\Datasheets\c_NX2012SA-STD-MUB-1_e.pdf; ComponentLink2Description: Local Datasheet; ComponentLink3URL: C:\ALTIUM_WORK\00001_MCHP-CDB\Library\LibraryRefs\Crystal 2 Pins.SchLib; ComponentLink3Description: Open Symbol; ComponentLink4URL: C:\ALTIUM_WORK\00001_MCHP-CDB\Library\Footprints\CRYSTAL_NX2012SA.PcbLib; ComponentLink4Description: Open Footprint; ComponentLink5Description: Open Footprint 2; ComponentLink6Description: Open Footprint 3; ComponentLink7Description: Open Footprint 4; Type: Crystal; Category: Crystal/Oscillator; Supplier 1: Digi-Key; Supplier Part Number 1: 644-1219-1-ND; Quantity Override: 1
Y2 = MIC6659: Manufacturer 1: Microchip Technology; Manufacturer Part Number 1: DSC1001DI5-024.0000T; Description_: MCHP CLOCK OSCILLATOR SINGLE 24MHz DSC1001DI5-024.0000 SMD-2520; Dev Tools Status: Design; Owner: Maurizio Gavardoni; Populated: YES; MCHP-ID: MIC6659; Revision: A; Symbol: DSC10xx DFN-4; Status: MCL Design; ComponentLink1Description: SVN Datasheet; ComponentLink2Description: Local Datasheet; ComponentLink3URL: C:\ALTIUM_WORK\00001_MCHP-CDB\Library\LibraryRefs\DSC10xx DFN-4.SchLib; ComponentLink3Description: Open Symbol; ComponentLink4URL: C:\ALTIUM_WORK\00001_MCHP-CDB\Library\Footprints\DFN-4_2.5x2.PcbLib; ComponentLink4Description: Open Footprint; ComponentLink5Description: Open Footprint 2; ComponentLink6Description: Open Footprint 3; ComponentLink7Description: Open Footprint 4; Category: MCHP-Clock/Timing; Type: Oscillator; Supplier 1: Digi-Key; Supplier Part Number 1: DSC1001DI5-024.0000T-ND; Quantity Override: 1
Y3 = OSC_24MHz: Crystal; Manufacturer 1: Abracon Corporation; MCHP-ID: OSC1047; Description_: CRYSTAL 24MHz 18pF SMD ABM8G; Dev Tools Status: Production; Owner: Mark Loper; Populated: DNP; Revision: 1; Symbol: Crystal 4 Pins; Status: MCL Design; ComponentLink1URL: https://chn-vm-apps.microchip.com/mchprepo/parts/Datasheets/ABM8G.pdf; ComponentLink1Description: SVN Datasheet; ComponentLink2URL: C:\ALTIUM_WORK\00001_MCHP-CDB\Datasheets\ABM8G.pdf; ComponentLink2Description: Local Datasheet; ComponentLink3URL: C:\ALTIUM_WORK\00001_MCHP-CDB\Library\LibraryRefs\Crystal 4 Pins.SchLib; ComponentLink3Description: Open Symbol; ComponentLink4URL: C:\ALTIUM_WORK\00001_MCHP-CDB\Library\Footprints\CRYSTAL_ABM8G.PcbLib; ComponentLink4Description: Open Footprint; ComponentLink5Description: Open Footprint 2; ComponentLink6Description: Open Footprint 3; ComponentLink7Description: Open Footprint 4; Package: ABM8G; Type: Crystal; Category: Crystal/Oscillator; Supplier 1: Digi-Key; Supplier Part Number 1: 535-10273-1-ND; Quantity Override: 1
Y4 = MIC8888: Manufacturer 1: Microchip Technology; Manufacturer Part Number 1: DSC6003MA3B-032K768; Description_: MCHP CLOCK OSCILLATOR SINGLE 32.768KHz DSC6003MA3B-032K768 SMD DFN-4; Dev Tools Status: Design; Owner: Ciprian Abramov; Populated: DNP; MCHP-ID: MIC8888; Revision: 1; Symbol: DSC60xx DFN-4_LGA-4; Status: MCL Design; ComponentLink1Description: SVN Datasheet; ComponentLink2Description: Local Datasheet; ComponentLink3URL: C:\ALTIUM_WORK\00001_MCHP-CDB\Library\LibraryRefs\DSC60xx DFN-4_LGA-4.SchLib; ComponentLink3Description: Open Symbol; ComponentLink4URL: C:\ALTIUM_WORK\00001_MCHP-CDB\Library\Footprints\DFN-4_2x1.6.PcbLib; ComponentLink4Description: Open Footprint; ComponentLink5Description: Open Footprint 2; ComponentLink6Description: Open Footprint 3; ComponentLink7Description: Open Footprint 4; Category: MCHP-Clock/Timing; Type: Oscillator; Supplier 1: Digi-Key; Supplier Part Number 1: DSC6003MA3B-032K768-ND; Quantity Override: 1; Supplier 2: Mouser; Supplier Part Number 2: 579-6003MA3B032K768